# EAGLE board ROHM_102022 (EAGLE 9.6.2), part 1 of 2
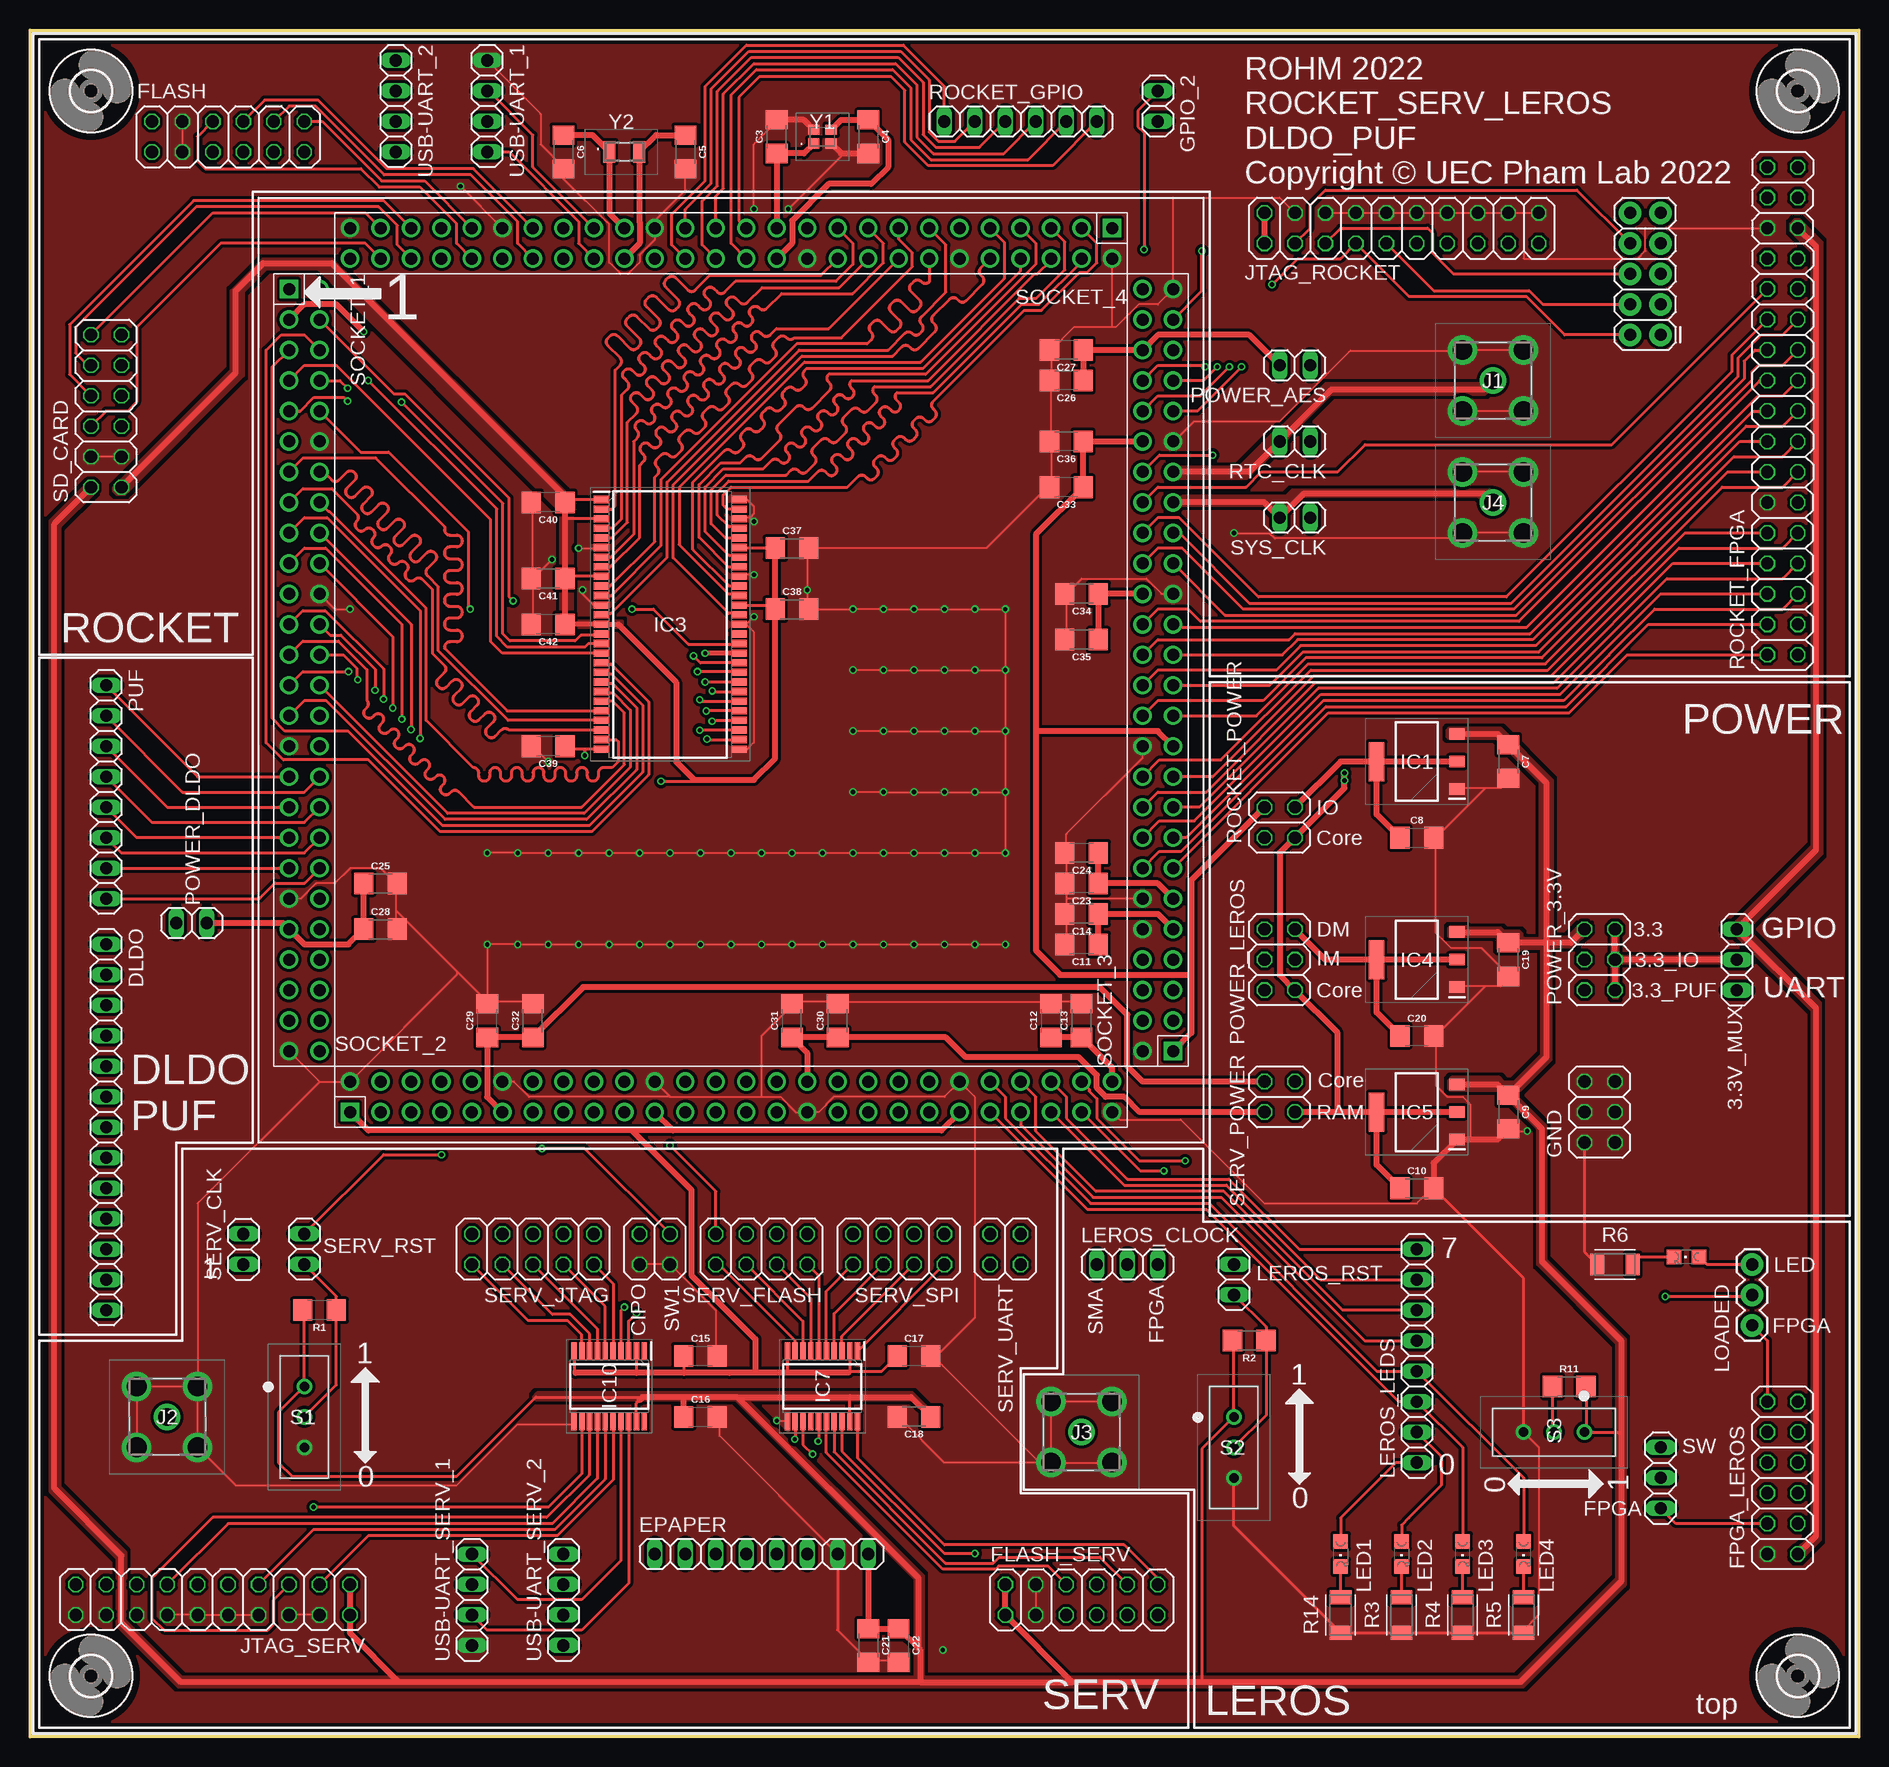
[diagram p5: board, top side]
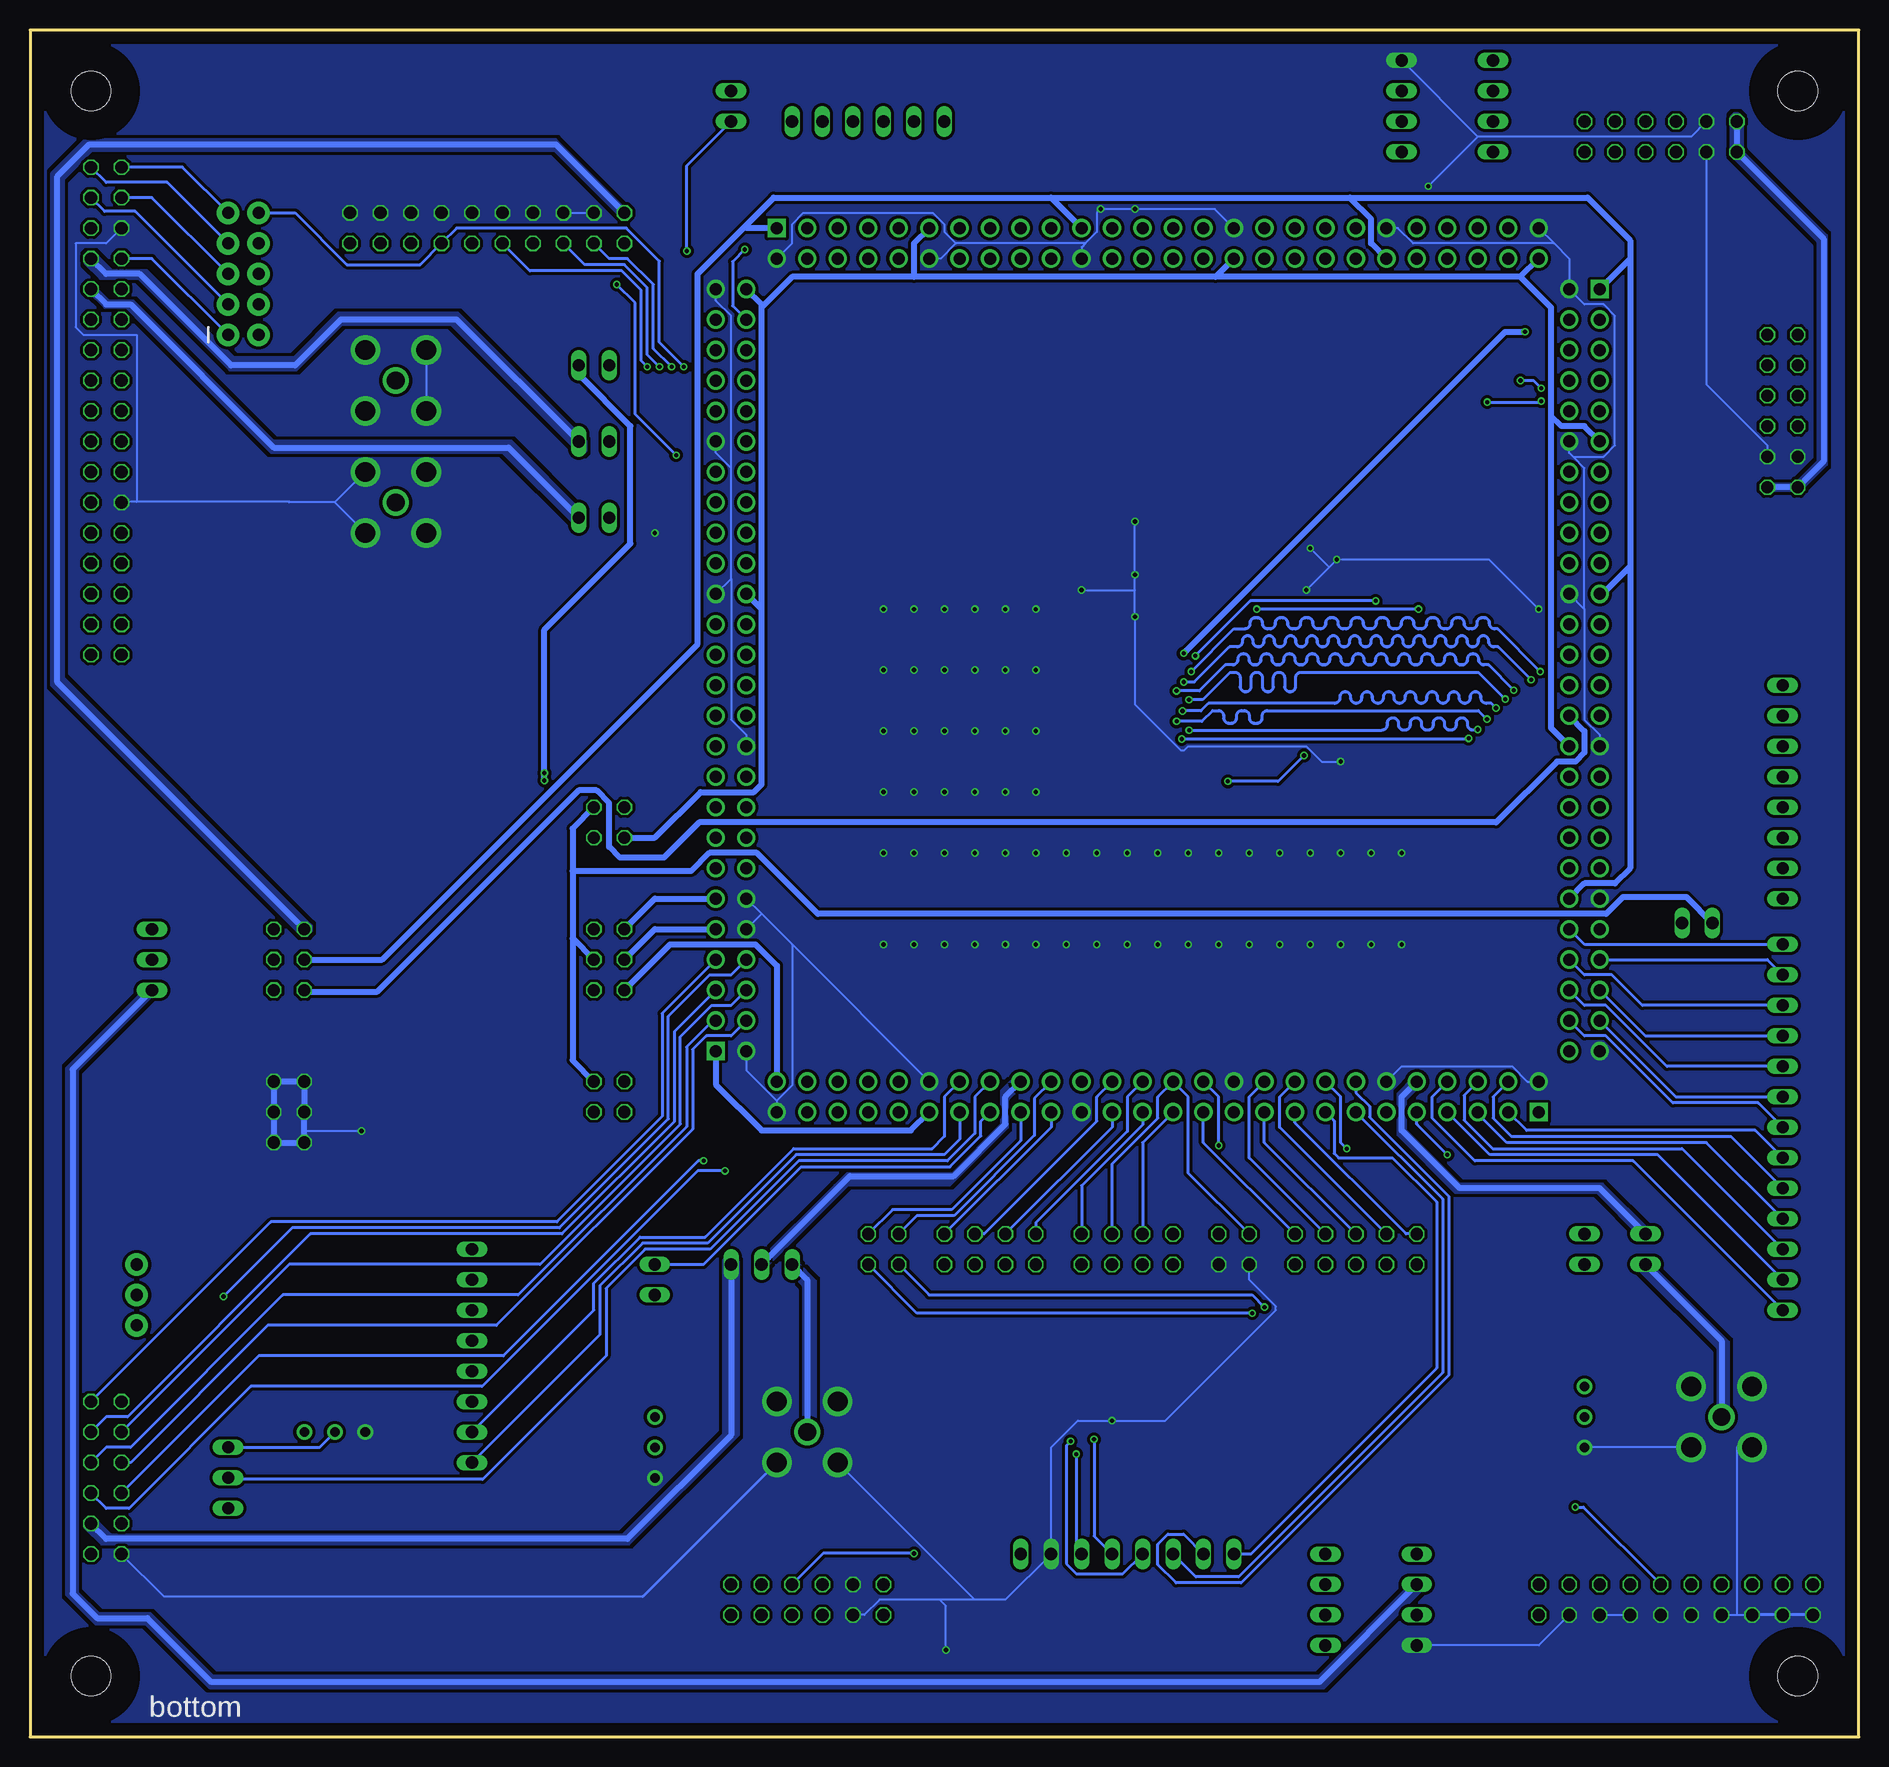
[diagram p6: board, bottom side, seen from below]

Size 152.4 x 142.24 mm. Coordinates in mm from the lower left corner, seen from the top.
Outline: 0,142.24 152.4,142.24 152.4,0 0,0 0,142.24
Copper layers (1*16): Top 0.035mm / dielectric 1.5mm / Bottom 0.035mm
Design rules "default *": minimum track width 6mil, minimum drill 0.35mm, track to track 10mil, track to pad 10mil, pad to pad 6mil, via to via 10mil, smd to smd 10mil, copper to edge 40mil, drill to drill 6mil, minimum pad ring 0.13mm, minimum via ring 0.13mm, stop-mask expansion 4mil, vias tented up to drill 0mil, thermal gap 10mil

## Footprints (pad centres in the part's own frame; a part is rotated, then mirrored left to right if it is on the bottom)
1X03 = drill 1.016 long: 1 -2.54,0; 2 0,0; 3 2.54,0
1206 = smd 1.6 x 1.8: 1 -1.4,0; 2 1.4,0
1X13 = drill 1.016 long: 1 -15.24,0; 2 -12.7,0; 3 -10.16,0; 4 -7.62,0; 5 -5.08,0; 6 -2.54,0; 7 0,0; 8 2.54,0; 9 5.08,0; 10 7.62,0; 11 10.16,0; 12 12.7,0; 13 15.24,0
1X08 = drill 1.016 long: 1 -8.89,0; 2 -6.35,0; 3 -3.81,0; 4 -1.27,0; 5 1.27,0; 6 3.81,0; 7 6.35,0; 8 8.89,0
2X06 = drill 1.016 octagon: 1 -6.35,-1.27; 2 -6.35,1.27; 3 -3.81,-1.27; 4 -3.81,1.27; 5 -1.27,-1.27; 6 -1.27,1.27; 7 1.27,-1.27; 8 1.27,1.27; 9 3.81,-1.27; 10 3.81,1.27; 11 6.35,-1.27; 12 6.35,1.27
2X03 = drill 1.016 octagon: 1 -2.54,-1.27; 2 -2.54,1.27; 3 0,-1.27; 4 0,1.27; 5 2.54,-1.27; 6 2.54,1.27
1X02 = drill 1.016 long: 1 -1.27,0; 2 1.27,0
3,3 = hole 3.3: 0,0
SOT229P700X180-4N = smd 1.3 x 0.95: 1 -3.35,2.29; 2 -3.35,0; 3 -3.35,-2.29 | smd 1.3 x 3.25: 4 3.35,0
SOP80P1176X120-54N = smd 1.295 x 0.6: 1 -5.728,10.4; 2 -5.728,9.6; 3 -5.728,8.8; 4 -5.728,8; 5 -5.728,7.2; 6 -5.728,6.4; 7 -5.728,5.6; 8 -5.728,4.8; 9 -5.728,4; 10 -5.728,3.2; 11 -5.728,2.4; 12 -5.728,1.6; 13 -5.728,0.8; 14 -5.728,0; 15 -5.728,-0.8; 16 -5.728,-1.6; 17 -5.728,-2.4; 18 -5.728,-3.2; 19 -5.728,-4; 20 -5.728,-4.8; 21 -5.728,-5.6; 22 -5.728,-6.4; 23 -5.728,-7.2; 24 -5.728,-8; 25 -5.728,-8.8; 26 -5.728,-9.6; 27 -5.728,-10.4; 28 5.728,-10.4; 29 5.728,-9.6; 30 5.728,-8.8; 31 5.728,-8; 32 5.728,-7.2; 33 5.728,-6.4; 34 5.728,-5.6; 35 5.728,-4.8; 36 5.728,-4; 37 5.728,-3.2; 38 5.728,-2.4; 39 5.728,-1.6; 40 5.728,-0.8; 41 5.728,0; 42 5.728,0.8; 43 5.728,1.6; 44 5.728,2.4; 45 5.728,3.2; 46 5.728,4; 47 5.728,4.8; 48 5.728,5.6; 49 5.728,6.4; 50 5.728,7.2; 51 5.728,8; 52 5.728,8.8; 53 5.728,9.6; 54 5.728,10.4
SOP65P640X120-20N = smd 1.475 x 0.45: 1 -2.938,2.925; 2 -2.938,2.275; 3 -2.938,1.625; 4 -2.938,0.975; 5 -2.938,0.325; 6 -2.938,-0.325; 7 -2.938,-0.975; 8 -2.938,-1.625; 9 -2.938,-2.275; 10 -2.938,-2.925; 11 2.938,-2.925; 12 2.938,-2.275; 13 2.938,-1.625; 14 2.938,-0.975; 15 2.938,-0.325; 16 2.938,0.325; 17 2.938,0.975; 18 2.938,1.625; 19 2.938,2.275; 20 2.938,2.925
29856004 = drill 1.64 pad 2.46: 1 0,0; 2 5.08,0; 3 5.08,5.08; 4 0,5.08 | drill 1.47 pad 2.205: 5 2.54,2.54
1X03' = drill 1.016 pad 1.88: 1 0,0; 2 2.54,0; 3 5.08,0
2X5 = drill 1.016 pad 1.88: 1 0,0; 2 0,2.54; 3 2.54,0; 4 2.54,2.54; 5 5.08,0; 6 5.08,2.54; 7 7.62,0; 8 7.62,2.54; 9 10.16,0; 10 10.16,2.54
2X02 = drill 1.016 octagon: 1 -1.27,-1.27; 2 -1.27,1.27; 3 1.27,-1.27; 4 1.27,1.27
2X10 = drill 1.016 octagon: 1 -11.43,-1.27; 2 -11.43,1.27; 3 -8.89,-1.27; 4 -8.89,1.27; 5 -6.35,-1.27; 6 -6.35,1.27; 7 -3.81,-1.27; 8 -3.81,1.27; 9 -1.27,-1.27; 10 -1.27,1.27; 11 1.27,-1.27; 12 1.27,1.27; 13 3.81,-1.27; 14 3.81,1.27; 15 6.35,-1.27; 16 6.35,1.27; 17 8.89,-1.27; 18 8.89,1.27; 19 11.43,-1.27; 20 11.43,1.27
CHIPLED_0805 = smd 1.2 x 1.2: A 0,-1.05; C 0,1.05
RESC3216X70 = smd 1.165 x 1.815: 1 -1.475,0; 2 1.475,0
2X17 = drill 1.016 octagon: 1 -20.32,-1.27; 2 -20.32,1.27; 3 -17.78,-1.27; 4 -17.78,1.27; 5 -15.24,-1.27; 6 -15.24,1.27; 7 -12.7,-1.27; 8 -12.7,1.27; 9 -10.16,-1.27; 10 -10.16,1.27; 11 -7.62,-1.27; 12 -7.62,1.27; 13 -5.08,-1.27; 14 -5.08,1.27; 15 -2.54,-1.27; 16 -2.54,1.27; 17 0,-1.27; 18 0,1.27; 19 2.54,-1.27; 20 2.54,1.27; 21 5.08,-1.27; 22 5.08,1.27; 23 7.62,-1.27; 24 7.62,1.27; 25 10.16,-1.27; 26 10.16,1.27; 27 12.7,-1.27; 28 12.7,1.27; 29 15.24,-1.27; 30 15.24,1.27; 31 17.78,-1.27; 32 17.78,1.27; 33 20.32,-1.27; 34 20.32,1.27
1X06 = drill 1.016 long: 1 -6.35,0; 2 -3.81,0; 3 -1.27,0; 4 1.27,0; 5 3.81,0; 6 6.35,0
SS12SDP2 = drill 0.8 pad 1.3: 1 0,2.54; 2 0,0; 3 0,-2.54
2X04 = drill 1.016 octagon: 1 -3.81,-1.27; 2 -3.81,1.27; 3 -1.27,-1.27; 4 -1.27,1.27; 5 1.27,-1.27; 6 1.27,1.27; 7 3.81,-1.27; 8 3.81,1.27
2X05 = drill 1.016 octagon: 1 -5.08,-1.27; 2 -5.08,1.27; 3 -2.54,-1.27; 4 -2.54,1.27; 5 0,-1.27; 6 0,1.27; 7 2.54,-1.27; 8 2.54,1.27; 9 5.08,-1.27; 10 5.08,1.27
2X26_HEADER = drill 1 pad 1.524 square: 1 -31.75,-1.27 | drill 1 pad 1.524: 2 -31.75,1.27; 3 -29.21,-1.27; 4 -29.21,1.27; 5 -26.67,-1.27; 6 -26.67,1.27; 7 -24.13,-1.27; 8 -24.13,1.27; 9 -21.59,-1.27; 10 -21.59,1.27; 11 -19.05,-1.27; 12 -19.05,1.27; 13 -16.51,-1.27; 14 -16.51,1.27; 15 -13.97,-1.27; 16 -13.97,1.27; 17 -11.43,-1.27; 18 -11.43,1.27; 19 -8.89,-1.27; 20 -8.89,1.27; 21 -6.35,-1.27; 22 -6.35,1.27; 23 -3.81,-1.27; 24 -3.81,1.27; 25 -1.27,-1.27; 26 -1.27,1.27; 27 1.27,-1.27; 28 1.27,1.27; 29 3.81,-1.27; 30 3.81,1.27; 31 6.35,-1.27; 32 6.35,1.27; 33 8.89,-1.27; 34 8.89,1.27; 35 11.43,-1.27; 36 11.43,1.27; 37 13.97,-1.27; 38 13.97,1.27; 39 16.51,-1.27; 40 16.51,1.27; 41 19.05,-1.27; 42 19.05,1.27; 43 21.59,-1.27; 44 21.59,1.27; 45 24.13,-1.27; 46 24.13,1.27; 47 26.67,-1.27; 48 26.67,1.27; 49 29.21,-1.27; 50 29.21,1.27; 51 31.75,-1.27; 52 31.75,1.27
1X04 = drill 1.016 long: 1 -3.81,0; 2 -1.27,0; 3 1.27,0; 4 3.81,0
Q22FA1280034500 = smd 0.95 x 0.85: 1 -0.725,-0.575; 2 0.725,-0.575; 3 0.725,0.575; 4 -0.725,0.575
Q13FC1350000400 = smd 1 x 1.8: 1 -1.25,0; 2 1.25,0

## Placement (x,y rotation side)
3.3V_MUX  [1X03]  142.24,64.77 90 top
C3  10pF  [1206]  62.23,133.35 90 top
C4  10pF  [1206]  69.85,133.35 270 top
C5  15pF  [1206]  54.61,132.08 270 top
C6  15pF  [1206]  44.45,132.08 270 top
C7  100uF  [1206]  123.19,81.28 270 top
C8  22uF  [1206]  115.57,74.93 0 top
C9  100uF  [1206]  123.19,52.07 270 top
C10  22uF  [1206]  115.57,45.72 0 top
C11  0.1uF  [1206]  87.63,66.04 180 top
C12  0.1uF  [1206]  85.09,59.69 90 top
C13  10uF  [1206]  87.63,59.69 90 top
C14  10uF  [1206]  87.63,68.58 180 top
C15  0.1uF  [1206]  55.88,31.75 0 top
C16  0.1uF  [1206]  55.88,26.67 0 top
C17  0.1uF  [1206]  73.66,31.75 0 top
C18  0.1uF  [1206]  73.66,26.67 180 top
C19  100uF  [1206]  123.19,64.77 270 top
C20  22uF  [1206]  115.57,58.42 0 top
C21  0.1uF  [1206]  69.85,7.62 270 top
C22  10uF  [1206]  72.39,7.62 270 top
C23  0.1uF  [1206]  87.63,71.12 180 top
C24  10uF  [1206]  87.63,73.66 180 top
C25  0.1uF  [1206]  29.21,71.12 0 top
C26  0.1uF  [1206]  86.36,113.03 180 top
C27  10uF  [1206]  86.36,115.57 180 top
C28  10uF  [1206]  29.21,67.31 0 top
C29  0.1uF  [1206]  38.1,59.69 90 top
C30  0.1uF  [1206]  67.31,59.69 90 top
C31  10uF  [1206]  63.5,59.69 90 top
C32  10uF  [1206]  41.91,59.69 90 top
C33  0.1uF  [1206]  86.36,104.14 180 top
C34  0.1uF  [1206]  87.63,95.25 180 top
C35  10uF  [1206]  87.63,91.44 180 top
C36  10uF  [1206]  86.36,107.95 180 top
C37  0.1uF  [1206]  63.5,99.06 0 top
C38  0.1uF  [1206]  63.5,93.98 0 top
C39  0.1uF  [1206]  43.18,82.55 180 top
C40  0.1uF  [1206]  43.18,102.87 180 top
C41  0.1uF  [1206]  43.18,96.52 180 top
C42  0.1uF  [1206]  43.18,92.71 180 top
DLDO  [1X13]  6.35,50.8 270 top
EPAPER  [1X08]  60.96,15.24 0 top
FLASH  PINHD-2X6  [2X06]  16.51,133.35 0 top
FLASH_SERV  PINHD-2X6  [2X06]  87.63,11.43 0 top
FPGA_LEROS  [2X06]  146.05,21.59 90 top
GND  PINHD-2X3  [2X03]  130.81,52.07 90 top
GPIO_2  [1X02]  93.98,135.89 270 top
H1  MOUNT-HOLE3.3  [3,3]  147.32,137.16 0 top
H2  MOUNT-HOLE3.3  [3,3]  147.32,5.08 0 top
H3  MOUNT-HOLE3.3  [3,3]  5.08,5.08 0 top
H4  MOUNT-HOLE3.3  [3,3]  5.08,137.16 0 top
IC1  AMS1117-1.8  [SOT229P700X180-4N]  115.57,81.28 180 top
IC3  W9825G6KH-6I  [SOP80P1176X120-54N]  53.34,92.71 0 top
IC4  AMS1117-1.8  [SOT229P700X180-4N]  115.57,64.77 180 top
IC5  AMS1117-1.8  [SOT229P700X180-4N]  115.57,52.07 180 top
IC7  TXB0108PWR  [SOP65P640X120-20N]  66.04,29.21 270 top
IC10  TXB0108PWR  [SOP65P640X120-20N]  48.26,29.21 270 top
J1  2985-6004  [29856004]  119.38,110.49 0 top
J2  2985-6004  [29856004]  8.89,24.13 0 top
J3  2985-6004  [29856004]  85.09,22.86 0 top
J4  2985-6004  [29856004]  119.38,100.33 0 top
J5  [1X03']  143.51,34.29 90 top
J6  [2X5]  135.89,116.84 90 top
JP1  [1X03]  135.89,21.59 90 top
JP3  PINHD-2X2  [2X02]  52.07,40.64 180 top
JTAG_ROCKET  [2X10]  114.3,125.73 0 top
JTAG_SERV  [2X10]  15.24,11.43 180 top
LED1  [CHIPLED_0805]  109.22,15.24 180 top
LED2  [CHIPLED_0805]  114.3,15.24 180 top
LED3  [CHIPLED_0805]  119.38,15.24 180 top
LED4  [CHIPLED_0805]  124.46,15.24 180 top
LEROS_CLOCK  PINHD-1X3  [1X03]  91.44,39.37 0 top
LEROS_LEDS  [1X08]  115.57,31.75 90 top
LEROS_RST  [1X02]  100.33,38.1 270 top
LOADED  [CHIPLED_0805]  138.05,40.01 90 top
POWER_3.3V  [2X03]  130.81,64.77 90 top
POWER_AES  [1X02]  105.41,114.3 180 top
POWER_DLDO  [1X02]  13.46,67.82 0 top
POWER_LEROS  [2X03]  104.14,64.77 90 top
PUF  [1X08]  6.35,78.74 270 top
R1  10k  [1206]  24.13,35.56 180 top
R2  10k  [1206]  101.6,33.02 180 top
R3  330  [RESC3216X70]  114.3,10.16 90 top
R4  330  [RESC3216X70]  119.38,10.16 90 top
R5  330  [RESC3216X70]  124.46,10.16 90 top
R6  330  [RESC3216X70]  132.08,39.37 0 top
R11  10k  [1206]  128.27,29.21 0 top
R14  330  [RESC3216X70]  109.22,10.16 90 top
ROCKET_FPGA  [2X17]  146.05,110.49 90 top
ROCKET_GPIO  [1X06]  82.55,134.62 0 top
ROCKET_POWER  [2X02]  104.14,76.2 90 top
RTC_CLK  [1X02]  105.41,107.95 180 top
S1  SS12SDP2  [SS12SDP2]  22.86,26.67 0 top
S2  SS12SDP2  [SS12SDP2]  100.33,24.13 0 top
S3  SS12SDP2  [SS12SDP2]  127,25.4 270 top
SD_CARD  PINHD-2X6  [2X06]  6.35,110.49 90 top
SERV_CLK  [1X02]  17.78,40.64 90 top
SERV_FLASH  [2X04]  60.96,40.64 180 top
SERV_JTAG  PINHD-2X5  [2X05]  41.91,40.64 180 top
SERV_POWER  [2X02]  104.14,53.34 90 top
SERV_RST  [1X02]  22.86,40.64 270 top
SERV_SPI  [2X04]  72.39,40.64 180 top
SERV_UART  PINHD-2X2  [2X02]  81.28,40.64 180 top
SOCKET_1  [2X26_HEADER]  22.86,88.9 270 top
SOCKET_2  [2X26_HEADER]  58.42,53.34 0 top
SOCKET_3  [2X26_HEADER]  93.98,88.9 90 top
SOCKET_4  [2X26_HEADER]  58.42,124.46 180 top
SYS_CLK  [1X02]  105.41,101.6 180 top
USB-UART_1  PINHD-1X4  [1X04]  38.1,135.89 270 top
USB-UART_2  PINHD-1X4  [1X04]  30.48,135.89 270 top
USB-UART_SERV_1  PINHD-1X4  [1X04]  36.83,11.43 90 top
USB-UART_SERV_2  PINHD-1X4  [1X04]  44.45,11.43 90 top
Y1  Q22FA1280034500  [Q22FA1280034500]  66.04,133.35 0 top
Y2  Q13FC1350000400  [Q13FC1350000400]  49.53,132.08 0 top

## Tracks (layer width: path | path; a pad name or v marks a point on that pad's centre or on a via)
CLOCK_EXTSERMEM_CLOCK_0
  Top 0.508: SOCKET_3.39 101.6,105.41 RTC_CLK.2 108.46,112.27 121.16,112.27 J1.5
  pour Top (no thermals): 95,105.79 94.87,105.66 94.87,105.03 95,104.9 101.47,104.9 108.46,111.89 121.28,111.89 122.17,112.78 122.17,113.16 121.92,113.41 121.67,113.41 121.03,112.78 107.7,112.78 100.71,105.79
CLOCK_EXTSERMEM_CLOCK_0_GPIO
  Bottom 0.508: RTC_CLK.1 116.84,118.11 126.49,118.11 130.3,114.3 135.64,114.3 143.26,121.92 146.05,121.92 ROCKET_FPGA.27
  pour Bottom (no thermals): 106.05,107.95 116.71,118.62 126.75,118.62 130.43,114.94 135.38,114.94 142.62,122.17 145.54,122.17 147.07,123.7 147.57,123.7 147.83,123.44 147.83,122.81 146.56,121.54 143.38,121.54 135.76,113.92 130.18,113.92 126.36,117.73 117.35,117.73 106.55,106.93 106.3,106.93 106.05,107.19
CLOCK_RTCNODE_RTC_CLOCK_XI
  Top 0.508: SOCKET_4.33 48.28,126.98 Y2.1 46.88,133.48 C6.1
CLOCK_RTCNODE_RTC_CLOCK_XO
  Top 0.508: SOCKET_4.34 50.8,124.46 50.8,126.26 50.78,126.28 Y2.2 52.18,133.48 C5.1
CLOCK_SDRAMCLOCKGROUP_0_XI
  Top 0.508: SOCKET_4.23 C3.1 64.49,131.95 Y1.1
CLOCK_SDRAMCLOCKGROUP_0_XO
  Top 0.508: SOCKET_4.24 63.5,124.46 63.5,126.37 66.55,129.41 70.1,129.41 71.5,130.81 71.5,133.1 C4.1 67.59,134.75 Y1.3
DLDO_PAD_COARSE_0
  Bottom 0.254: SOCKET_2.3 27.69,50.55 8.64,50.55 DLDO.8
DLDO_PAD_COMP1_0
  Bottom 0.254: SOCKET_1.47 17.78,58.42 DLDO.4
DLDO_PAD_FINE_0
  Bottom 0.254: DLDO.9 10.67,50.04 28.96,50.04 30.48,51.56 30.48,53.34 SOCKET_2.4
DLDO_PAD_I_FRZ_0
  Bottom 0.254: DLDO.3 18.03,60.96 20.57,63.5 22.86,63.5 SOCKET_1.46
DLDO_PAD_I_SET_0
  Bottom 0.254: SOCKET_1.45 7.62,64.77 DLDO.2
DLDO_PAD_SIG1_0
  Bottom 0.254: SOCKET_2.5 31.75,51.94 29.34,49.53 12.7,49.53 DLDO.10
DLDO_PAD_SIG2_0
  Bottom 0.254: DLDO.11 14.73,49.02 30.52,49.02 32.89,51.39 32.89,53.47 SOCKET_2.6
DLDO_PAD_SIG3_0
  Bottom 0.254: SOCKET_2.7 30.73,48.51 16.76,48.51 DLDO.12
DLDO_PAD_SIG4_0
  Bottom 0.254: DLDO.13 18.8,48.01 32,48.01 35.56,51.56 35.56,53.34 SOCKET_2.8
DLDO_PAD_VDDP_0
  Top 0.508: POWER_DLDO.2 21.08,67.82 SOCKET_1.43 22.86,66.04 26.54,66.04 C28.1 C25.1
DLDO_PAD_VOUT_0
  Bottom 0.254: DLDO.1 6.38,66.02 22.84,66.02 SOCKET_1.44
DLDO_PAD_VREF1_0
  Bottom 0.254: SOCKET_1.49 15.24,53.34 DLDO.6
DLDO_PAD_VREF2_0
  Bottom 0.254: SOCKET_1.50 22.86,58.42 21.08,58.42 15.49,52.83 8.38,52.83 DLDO.7
DLDO_PAD_VREF_0
  Bottom 0.254: DLDO.5 16,55.88 21.08,60.96 22.86,60.96 SOCKET_1.48
FPGA_CLK_LEROS
  Bottom 0.508: LEROS_CLOCK.3 93.98,25.15 102.62,16.51 146.05,16.51 FPGA_LEROS.3
  pour Bottom (no thermals): 93.34,39.5 93.34,25.15 102.49,16 146.43,16 147.83,17.4 147.83,18.03 147.57,18.29 147.07,18.29 146.3,17.53 145.67,16.89 143.13,16.89 103,16.89 94.62,25.27 94.62,39.75 94.49,39.88 93.73,39.88 93.6,39.88 93.34,39.62
FPGA_GPIO_LEFT_0_0
  Top 0.254: ROCKET_GPIO.1 76.2,137.54 72.77,140.97 59.69,140.97 56.26,137.54 56.26,129.67 53.47,126.87 53.47,124.33 SOCKET_4.30
FPGA_GPIO_LEFT_0_1
  Top 0.254: SOCKET_4.29 54.61,127.3 56.77,129.46 56.77,137.33 59.9,140.46 72.56,140.46 74.93,138.09 74.93,133.73 75.7,132.96 77.08,132.96 ROCKET_GPIO.2
FPGA_GPIO_LEFT_0_2
  Top 0.254: SOCKET_4.28 56.01,124.33 56.01,127.98 57.28,129.25 57.28,137.12 60.11,139.95 72.35,139.95 74.42,137.88 74.42,133.52 75.49,132.46 79.12,132.46 ROCKET_GPIO.3
FPGA_GPIO_LEFT_0_3
  Top 0.254: SOCKET_4.27 57.15,128.4 57.79,129.04 57.79,136.91 60.32,139.45 72.14,139.45 73.91,137.67 73.91,133.31 75.28,131.95 81.15,131.95 ROCKET_GPIO.4
FPGA_GPIO_LEFT_0_4
  Top 0.254: SOCKET_4.26 58.42,124.46 58.42,136.83 60.53,138.94 71.88,138.94 73.41,137.41 73.41,133.1 75.07,131.44 83.18,131.44 ROCKET_GPIO.5
FPGA_GPIO_LEFT_0_5
  Top 0.254: ROCKET_GPIO.6 85.21,130.93 74.86,130.93 72.9,132.89 72.9,137.2 71.78,138.32 60.76,138.32 59.07,136.63 59.07,126.35 SOCKET_4.25
GND  (via drill 0.35)
  Top 0.152: J4.2 J4.1 119.38,100.28 118.97,99.87 103.73,99.87 103.33,100.28 100.48,100.28 v100.33,100.33 | J4.3 J4.4 | 121.28,79.06 122.56,79.06 123.19,79.69 C7.2 | 121.28,79.06 119.06,79.06 IC1.1 | 121.28,79.06 117.16,74.93 | 121.28,62.55 122.56,62.55 123.19,63.18 C19.2 123.19,63.5 120.97,65.72 118.43,65.72 117.16,66.99 117.16,74.93 | 121.28,62.55 119.06,62.55 IC4.1 | 121.28,62.55 117.16,58.42 | 120.02,49.78 120.02,52.71 119.38,53.34 118.11,53.34 117.16,54.29 117.16,58.42 | 117.16,58.42 C20.2 | 117.16,74.93 C8.2 | v124.78,50.48 123.19,50.48 C9.2 | JTAG_SERV.14 JTAG_SERV.12 JTAG_SERV.10 JTAG_SERV.8 | JTAG_SERV.4 JTAG_SERV.6 | J2.1 J2.4 J2.3 | IC10.11 45.4,26.04 40.64,26.04 35.56,20.96 17.15,20.96 J2.2 J2.3 | J3.3 J3.4 J3.1 | 84.14,22.86 76.2,22.86 72.39,26.67 C18.2 | 84.14,22.86 75.25,31.75 C17.2 75.56,31.75 78.74,34.93 78.74,53.34 SOCKET_2.42 76.2,53.34 66.99,53.34 65.72,52.07 SOCKET_2.31 63.82,52.07 62.55,53.34 60.96,53.34 | 84.14,22.86 J3.1 | J3.1 J3.2 | C15.2 57.15,31.75 57.15,35.56 JP3.2 JP3.4 | FLASH_SERV.4 FLASH_SERV.3 | 69.85,6.35 72.39,6.35 C22.2 | v62.23,26.35 63.18,26.35 IC7.11 | EPAPER.7 57.47,25.08 57.47,26.67 C16.2 | 67.31,8.89 69.85,6.35 | 69.85,6.35 C21.2 | v46.04,95.57 46.04,95.25 46.99,94.3 47.31,94.3 IC3.12 | 41.91,96.52 v43.5,98.11 | v45.72,99.06 47.31,99.06 IC3.6 | 41.91,96.52 41.91,92.71 C42.2 | 41.91,96.52 41.91,102.87 C40.2 | 41.91,96.52 C41.2 | v26.67,93.98 25.4,93.98 SOCKET_1.22 | USB-UART_1.1 42.55,135.25 42.55,132.72 44.45,130.81 C6.2 44.45,129.86 48.26,126.05 48.26,122.87 49.21,121.92 49.85,121.92 50.8,122.87 50.8,123.51 52.07,124.78 SOCKET_4.31 52.07,126.37 54.61,128.91 C5.2
  Top 0.152: SD_CARD.3 SD_CARD.4 | FLASH.4 FLASH.3 | v35.88,129.22 SOCKET_4.41 | 24.13,54.61 SOCKET_2.2 35.56,63.5 35.56,63.82 | SOCKET_1.51 24.13,54.61 | 38.1,61.28 41.91,61.28 C32.2 | 30.48,71.12 30.48,68.9 | 30.48,68.9 30.48,67.31 C28.2 | SOCKET_1.41 22.54,69.85 23.81,71.12 25.4,71.12 26.67,72.39 29.21,72.39 30.48,71.12 | 30.48,71.12 C25.2 | 30.48,68.9 35.56,63.82 | 35.56,63.82 38.1,61.28 | 38.1,61.28 C29.2 v38.1,66.04 v40.64,66.04 v43.18,66.04 v45.72,66.04 v48.26,66.04 v50.8,66.04 v53.34,66.04 v55.88,66.04 v58.42,66.04 v60.96,66.04 v63.5,66.04 v66.04,66.04 v68.58,66.04 v71.12,66.04 v73.66,66.04 v76.2,66.04 v78.74,66.04 v81.28,66.04 | 85.09,61.28 87.63,61.28 C13.2 | 67.31,61.28 63.5,61.28 C31.2 63.5,60.96 60.96,58.42 60.96,53.34 | 67.31,61.28 85.09,61.28 | 85.09,61.28 C12.2 | 67.31,61.28 C30.2 | 53.34,53.34 60.96,53.34 | SOCKET_2.22 53.34,53.34 | SOCKET_2.12 40.32,54.61 41.59,53.34 53.34,53.34 | 60.01,101.6 59.37,101.6 IC3.52 | 60.01,101.6 60.33,101.92 60.33,102.55 59.69,103.19 59.37,103.19 IC3.54 | 59.69,92.71 60.33,92.08 60.33,82.87 59.69,82.23 59.37,82.23 IC3.28 | IC3.41 59.69,92.71 | v60.33,96.84 59.37,96.84 IC3.46 | 59.69,92.71 v60.33,93.34 | v43.18,81.28 41.91,82.55 C39.2 | v60.33,101.28 60.01,101.6 | 85.09,115.57 85.09,113.03 | 85.09,107.95 85.09,104.14 C33.2 84.77,104.14 79.69,99.06 C37.2 64.77,99.06 v64.77,95.57 64.77,93.98 C38.2 v68.58,93.98 v71.12,93.98 v73.66,93.98 v76.2,93.98 v78.74,93.98 v81.28,93.98 v81.28,88.9 | 85.09,107.95 85.09,113.03 | 85.09,113.03 C26.2 | 85.09,107.95 C36.2 | J1.2 J1.1 | J1.3 J1.4 119.38,115.52 110.03,115.52 104.14,109.63 97.03,109.63 95.4,108 SOCKET_3.41
  Top 0.152: 86.36,68.58 86.36,66.04 C11.2 | 86.36,73.66 86.36,71.12 | 86.36,71.12 86.36,69.85 | 86.36,69.85 86.36,68.58 | 86.36,68.58 C14.2 | 86.36,71.12 C23.2 | SOCKET_3.22 92.71,81.6 86.36,75.25 86.36,73.66 | 86.36,73.66 C24.2 | SOCKET_3.12 86.36,69.85 | v60.33,127.32 60.33,132.72 62.23,134.62 C3.2 | v63.18,127.32 67.63,131.76 67.63,131.95 | 86.36,95.25 86.36,91.44 C35.2 | SOCKET_3.31 94.3,95.25 93.03,96.52 87.63,96.52 86.36,95.25 | 86.36,95.25 C34.2 | 85.09,115.57 87,117.48 90.17,117.48 | 90.17,117.48 90.49,117.48 92.39,119.38 93.98,119.38 SOCKET_3.51 95.25,128.27 104.14,128.27 JTAG_ROCKET.4 | 85.09,115.57 C27.2 | J2.3 13.97,44.45 24.13,54.61 | SOCKET_2.51 90.81,51.44 95.89,51.44 102.87,44.45 115.57,44.45 116.84,45.72 C10.2 | v38.1,73.66 v40.64,73.66 v43.18,73.66 v45.72,73.66 v48.26,73.66 v50.8,73.66 v53.34,73.66 v55.88,73.66 v58.42,73.66 v60.96,73.66 v63.5,73.66 v66.04,73.66 v68.58,73.66 v71.12,73.66 v73.66,73.66 v76.2,73.66 v78.74,73.66 v81.28,73.66 v81.28,78.74 | v68.58,78.74 v71.12,78.74 v73.66,78.74 v76.2,78.74 v78.74,78.74 v81.28,78.74 | v68.58,83.82 v71.12,83.82 v73.66,83.82 v76.2,83.82 v78.74,83.82 v81.28,83.82 | v81.28,83.82 v81.28,78.74 | v68.58,88.9 v71.12,88.9 v73.66,88.9 v76.2,88.9 v78.74,88.9 v81.28,88.9 | v81.28,88.9 v81.28,83.82 | S3.3 125.73,24.13 125.73,10.16 124.46,8.89 R5.1 | 90.17,117.48 SOCKET_4.2 | JTAG_ROCKET.6 JTAG_ROCKET.8 JTAG_ROCKET.10 JTAG_ROCKET.12 JTAG_ROCKET.14 JTAG_ROCKET.16 JTAG_ROCKET.18 124.46,127 | 124.46,127 JTAG_ROCKET.20 | ROCKET_FPGA.30 134.62,125.73 134.62,123.83 133.99,123.19 124.46,123.19 124.46,127
  Top 0.254: EPAPER.7 67.31,8.89 | R5.1 R4.1 R3.1 R14.1 100.33,17.58 S2.3 | GND.2 129.54,40.44 R6.1 | S3.3 124.46,38.23 C10.2
  Top 0.508: Y1.2 67.59,131.95 67.63,131.95 C4.2 | Y1.4 64.49,134.75 C3.2 | C9.2 122.3,49.78 120.02,49.78 IC5.1 116.97,47.83 C10.2
  Bottom 0.152: 127,102.87 130.81,102.87 130.76,102.92 143.51,102.92 | J4.3 127,102.87 | 127,102.87 J4.2 | v124.78,50.48 129.54,50.48 | JTAG_SERV.14 10.16,10.16 | 10.16,10.16 JTAG_SERV.16 | USB-UART_SERV_1.1 26.67,7.62 JTAG_SERV.4 | JTAG_SERV.6 JTAG_SERV.8 | J2.2 S1.3 | FLASH_SERV.3 82.87,10.16 81.6,11.43 76.58,11.43 | 73.66,11.43 71.12,11.43 EPAPER.7 67.31,24.13 65.09,26.35 v62.23,26.35 57.79,26.35 48.58,35.56 48.58,35.88 50.8,38.1 JP3.4 | 73.66,11.43 76.58,11.43 | 73.66,11.43 J3.1 | SOCKET_4.51 25.4,124.46 | 25.4,124.46 24.13,123.19 SOCKET_1.2 22.86,119.38 21.27,119.38 20.32,118.43 20.32,107.63 21.27,106.68 23.81,106.68 | SOCKET_4.41 38.42,125.73 37.15,124.46 25.4,124.46 | 44.13,97.47 v43.5,98.11 30.8,98.11 v26.67,93.98 | 44.13,97.47 v46.04,95.57 | 44.13,97.47 v45.72,99.06 | SOCKET_1.31 21.59,83.5 22.86,84.77 22.86,93.98 | SOCKET_1.22 22.86,93.98 | SOCKET_1.12 24.13,107 23.81,106.68 | 23.81,106.68 22.86,105.73 22.86,93.98 | SD_CARD.3 7.62,107.63 12.7,112.71 FLASH.3 | 31.75,133.35 USB-UART_1.1 | 31.75,133.35 13.97,133.35 FLASH.4 | 31.75,133.35 v35.88,129.22 | SOCKET_2.2 27.62,54.61 28.89,55.88 38.1,55.88 SOCKET_2.12 | 60.33,95.57 v60.33,93.34 60.33,86.04 56.52,82.23 56.2,82.23 55.88,82.55 46.04,82.55 44.77,81.28 v43.18,81.28 | 60.33,95.57 v60.33,96.84 v60.33,101.28 | v64.77,95.57 60.33,95.57 | J1.4 J1.1 | 90.17,53.02 SOCKET_2.51 | 90.17,53.02 92.71,55.56 SOCKET_3.2 | SOCKET_3.12 91.44,68.58 | 91.44,68.58 88.9,66.04 | 88.9,66.04 SOCKET_2.42 | 91.44,68.58 SOCKET_3.10 | 90.17,53.02 88.9,54.29 88.9,66.04 | SOCKET_4.31 53.66,127.32 v60.33,127.32 v63.18,127.32 63.5,127 63.5,125.41 64.45,124.46 | SOCKET_4.22 64.77,124.14 64.45,124.46
  Bottom 0.152: SOCKET_4.12 76.52,123.19 75.25,124.46 | 64.45,124.46 75.25,124.46 | SOCKET_3.41 95.25,107 93.98,105.73 | 93.98,96.52 93.98,105.73 | SOCKET_3.31 93.98,96.52 | SOCKET_3.51 95.25,119.7 93.98,118.43 93.98,105.73 | 75.25,124.46 76.2,125.41 76.2,126.05 77.15,127 87.95,127 88.9,126.05 88.9,124.46 SOCKET_4.2 | SOCKET_3.22 92.71,83.5 93.98,84.77 93.98,96.52 | 101.35,11.68 141.22,11.68 FPGA_LEROS.2 | v76.07,7.24 76.07,10.92 76.58,11.43 | 143.51,102.92 144.78,102.92 ROCKET_FPGA.12 | 10.16,10.16 10.16,24.13 J2.1 | JTAG_ROCKET.6 JTAG_ROCKET.4 | 143.51,102.92 143.51,116.84 147.95,116.84 148.59,117.48 148.59,124.46 146.05,124.46 ROCKET_FPGA.30
  Bottom 0.254: JTAG_SERV.20 JTAG_SERV.18 JTAG_SERV.16 | J3.2 101.35,11.68
  Bottom 0.508: GND.6 GND.4 129.54,50.48 GND.2 GND.1 GND.3 GND.5 GND.6
  pour Bottom (rank 2, no thermals): -7.62,151.13 162.56,151.13 162.56,123.19 162.56,-11.43 -3.81,-11.43 -7.62,-11.43
  pour Top (rank 2, no thermals): -7.62,151.13 162.56,151.13 162.56,125.73 162.56,-11.43 -7.62,-11.43
GPIO_GPIO_0  (via drill 0.35)
  Top 0.254: v92.83,123.96 92.83,133.69 92.32,134.2 92.32,135.5 GPIO_2.1
  Bottom 0.254: v92.83,123.96 93.85,122.94 93.85,119.25 SOCKET_3.50
GPIO_GPIO_1  (via drill 0.35)
  Top 0.254: SOCKET_3.49 97.66,120.52 v97.66,123.83
  Bottom 0.254: v97.66,123.83 97.66,130.94 GPIO_2.2
JTAG_TCK  (via drill 0.35)
  Top 0.254: v100.97,114.17 97.28,110.49 SOCKET_3.43 | JTAG_ROCKET.9 116.97,120.52 124.92,120.52 126.07,119.38 J6.4
  Bottom 0.254: v100.97,114.17 101.47,114.68 101.47,120.57 103.08,122.17 110.74,122.17 JTAG_ROCKET.9
JTAG_TCK_FPGA
  Bottom 0.254: J6.3 143.64,127.13 146.18,127.13 ROCKET_FPGA.31
JTAG_TDI  (via drill 0.35)
  Top 0.254: SOCKET_3.44 93.98,111.76 97.54,111.76 v99.95,114.17 | JTAG_ROCKET.5 109.22,125.73 116.46,125.73 116.84,125.35 116.84,123.7 118.62,121.92 J6.6
  Bottom 0.254: v99.95,114.17 100.97,115.19 100.97,120.78 102.87,122.68 106.17,122.68 JTAG_ROCKET.5
JTAG_TDI_FPGA
  Bottom 0.254: J6.5 142.24,128.27 ROCKET_FPGA.32
JTAG_TDO  (via drill 0.35)
  Top 0.254: SOCKET_3.46 93.98,114.3 97.79,114.3 v97.92,114.17
  Bottom 0.254: v97.92,114.17 99.95,116.21 99.95,122.98 102.7,125.73 116.84,125.73 JTAG_ROCKET.13 119.89,122.68 125.98,122.68 130.3,127 J6.10
JTAG_TDO_FPGA
  Bottom 0.254: J6.9 139.7,130.81 ROCKET_FPGA.34
JTAG_TMS  (via drill 0.35)
  Top 0.254: v98.55,106.81 94.11,106.81 SOCKET_3.40 | v103.5,121.03 105.66,123.19 109.22,123.19 JTAG_ROCKET.7 114.94,120.02 124.71,120.02 127.89,116.84 J6.2
  Bottom 0.254: v98.55,106.81 101.98,110.24 101.98,119.51 v103.5,121.03
JTAG_TMS_FPGA
  Bottom 0.254: J6.1 142.24,123.19 ROCKET_FPGA.28
JTAG_TRSTN  (via drill 0.35)
  Top 0.254: v98.93,114.17 97.79,113.03 SOCKET_3.45 | JTAG_ROCKET.3 106.68,125.73 106.68,127.64 107.95,128.91 128.91,128.91 J6.8
  Bottom 0.254: v98.93,114.17 100.46,115.7 100.46,121.03 102.61,123.19 104.14,123.19 JTAG_ROCKET.3
JTAG_TRSTN_FPGA
  Bottom 0.254: J6.7 140.97,129.54 146.05,129.54 ROCKET_FPGA.33
LEROS_PAD_CPU_RST_N_0
  Bottom 0.254: LEROS_RST.1 96.27,39.37 88.14,47.5 75.74,47.5 73.15,50.08 73.15,51.31 SOCKET_2.37
LEROS_PAD_I_CLK_0
  Bottom 0.508: LEROS_CLOCK.2 84.07,46.74 75.44,46.74 71.12,51.05 71.12,53.34 SOCKET_2.36
  pour Bottom: 91.06,39.12 84.2,45.97 77.09,45.97 75.69,45.97 70.87,50.8 70.87,53.09 69.98,53.98 69.47,54.48 69.47,54.99 69.6,55.12 70.23,55.12 71.5,53.85 71.5,51.82 71.5,51.05 75.56,46.99 84.33,46.99 85.34,45.97 91.82,39.5 91.82,39.24 91.82,39.12 91.44,38.74
LEROS_PAD_I_SPI_LOADER_CLK_0  (via drill 0.35)
  Top 0.254: v94.49,47.17 92.53,47.17 SOCKET_2.49
  Bottom 0.254: v94.49,47.17 96.77,47.17 114.73,29.21 133.99,29.21 144.14,19.05 146.05,19.05 FPGA_LEROS.5
LEROS_PAD_I_SPI_LOADER_CS_0  (via drill 0.35)
  Top 0.254: v96.27,48.01 92.46,48.01 88.9,51.56 88.9,53.19 88.27,53.82 88.27,53.98 SOCKET_2.50
  Bottom 0.254: v96.27,48.01 96.7,48.01 112.95,31.75 133.35,31.75 FPGA_LEROS.6
LEROS_PAD_I_SPI_LOADER_MOSI_0
  Bottom 0.254: SOCKET_3.3 95.49,59.69 97.69,57.49 97.69,50.86 111.72,36.83 131.32,36.83 144.02,24.13 146.05,24.13 FPGA_LEROS.7
LEROS_PAD_I_SPI_MISO_0
  Bottom 0.254: SOCKET_3.7 99.72,60.3 99.72,51.7 108.5,42.93 132.33,42.93 FPGA_LEROS.11
LEROS_PAD_LOADER_RST_N_0
  Bottom 0.254: SOCKET_2.38 73.66,53.34 73.66,50.29 75.95,48.01 88.35,48.01 95.71,40.64 101.14,40.64 104.39,37.39 104.39,31.75 113.16,22.99 114.68,21.46 135.76,21.46 JP1.2
LEROS_PAD_LOADER_RST_N_0_FPGA
  Top 0.254: FPGA_LEROS.4 137.16,17.78 JP1.1
LEROS_PAD_O_SPI_CLK_0
  Bottom 0.254: SOCKET_3.4 93.98,58.42 96.04,58.42 97.18,57.28 97.18,50.65 113.54,34.29 132.59,34.29 144.02,22.86 FPGA_LEROS.8
LEROS_PAD_O_SPI_CS_0
  Bottom 0.254: SOCKET_3.5 98.7,58.78 98.7,51.28 108.07,41.91 129.03,41.91 144.27,26.67 146.05,26.67 FPGA_LEROS.9
LEROS_PAD_O_SPI_MOSI_0
  Bottom 0.254: SOCKET_3.6 93.98,60.96 95.6,60.96 98.2,58.36 98.2,51.07 109.9,39.37 130.81,39.37 FPGA_LEROS.10
LEROS_PAD_OLEDG_0_0
  Top 0.254: LEROS_LEDS.1 113.82,22.86 109.22,18.26 LED1.A
  Bottom 0.254: SOCKET_2.39 74.93,49.78 76.2,48.51 88.56,48.51 95.93,41.15 101.35,41.15 104.9,37.6 104.9,33.53 LEROS_LEDS.1
LEROS_PAD_OLEDG_0_1
  Top 0.254: LEROS_LEDS.2 117.6,23.37 117.6,20.96 115,18.35 114.91,18.26 114.3,17.65 LED2.A
  Bottom 0.254: SOCKET_2.40 76.2,53.34 76.2,50.04 77.22,49.02 88.77,49.02 96.14,41.66 101.56,41.66 105.41,37.81 105.41,35.56 LEROS_LEDS.2
LEROS_PAD_OLEDG_0_2
  Top 0.254: SOCKET_2.43 88.14,43.94 98.04,43.94 114.05,27.94 LEROS_LEDS.3 119.38,24.13 LED3.A
LEROS_PAD_OLEDG_0_3
  Top 0.254: SOCKET_2.44 81.28,53.34 81.28,51.56 88.39,44.45 98.25,44.45 112.22,30.48 LEROS_LEDS.4 124.46,21.59 LED4.A
LEROS_PAD_OLEDG_0_4
  Top 0.254: LEROS_LEDS.5 111.22,33.02 99.28,44.96 88.6,44.96 82.55,51.01 SOCKET_2.45
LEROS_PAD_OLEDG_0_5
  Top 0.254: SOCKET_2.46 83.82,53.34 83.82,50.46 88.81,45.47 99.49,45.47 109.4,35.56 LEROS_LEDS.6
LEROS_PAD_OLEDG_0_6
  Top 0.254: SOCKET_2.47 91.19,45.97 99.7,45.97 107.57,38.1 LEROS_LEDS.7
LEROS_PAD_OLEDG_0_7
  Top 0.254: SOCKET_2.48 86.36,53.34 86.36,51.56 91.44,46.48 99.91,46.48 105.75,40.64 LEROS_LEDS.8
LEROS_PAD_SRAM_LOADED_0  (via drill 0.35)
  Top 0.254: v136.27,36.7 143.38,36.7 J5.2
  Bottom 0.254: SOCKET_3.8 93.98,63.5 95.76,63.5 99.21,60.05 99.21,51.49 108.29,42.42 130.56,42.42 v136.27,36.7
LEROS_PAD_SRAM_LOADED_0_FPGA
  Top 0.254: J5.1 144.78,33.02 FPGA_LEROS.12
LEROS_PAD_VDD_0
  Top 0.508: SOCKET_2.52 90.17,55.75 C13.1 C12.1
  Bottom 0.508: POWER_LEROS.2 99.06,66.04 91.95,66.04 90.17,64.26 SOCKET_2.52
LEROS_PAD_VDD_DM_RAM_0
  Top 0.508: SOCKET_3.11 93.98,71.12 C23.1 C24.1
  Bottom 0.508: POWER_LEROS.6 100.33,69.85 SOCKET_3.11
LEROS_PAD_VDD_IM_RAM_0
  Top 0.508: C11.1 C14.1 93.98,68.58 SOCKET_3.9
  Bottom 0.508: SOCKET_3.9 100.33,67.31 POWER_LEROS.4
MEMSER_PAD_IN_READY
  Top 0.254: SOCKET_3.36 93.98,101.6 95.76,101.6 102.36,95 123.04,95 141.83,113.79 141.83,115.16 ROCKET_FPGA.24
MEMSER_PAD_IN_VALID
  Top 0.254: SOCKET_3.34 93.98,99.06 96.01,99.06 101.09,93.98 123.66,93.98 142.85,113.17 142.85,114.66 143.76,115.57 ROCKET_FPGA.22
MEMSER_PAD_OUT_BITS_0
  Top 0.254: SOCKET_3.13 108.2,85.34 128.27,85.34 133.1,90.17 ROCKET_FPGA.2
MEMSER_PAD_OUT_BITS_1
  Top 0.254: SOCKET_3.14 94.11,73.79 95.93,73.79 107.99,85.85 128.02,85.85 134.87,92.71 ROCKET_FPGA.4
MEMSER_PAD_OUT_BITS_2
  Top 0.254: SOCKET_3.15 96.35,74.93 107.78,86.36 127.81,86.36 131.57,90.13 131.57,90.17 135.38,93.98 146.05,93.98 ROCKET_FPGA.5
MEMSER_PAD_OUT_BITS_3
  Top 0.254: SOCKET_3.16 94.11,76.33 97.03,76.33 107.57,86.87 127.51,86.87 135.89,95.25 ROCKET_FPGA.6
MEMSER_PAD_OUT_BITS_4
  Top 0.254: SOCKET_3.17 97.46,77.47 107.36,87.38 127.25,87.38 136.4,96.52 146.05,96.52 ROCKET_FPGA.7
MEMSER_PAD_OUT_BITS_5
  Top 0.254: SOCKET_3.18 93.98,78.74 98.01,78.74 107.15,87.88 127,87.88 136.91,97.79 ROCKET_FPGA.8
MEMSER_PAD_OUT_BITS_6
  Top 0.254: SOCKET_3.19 98.56,80.01 106.94,88.39 126.75,88.39 137.41,99.06 146.05,99.06 ROCKET_FPGA.9
MEMSER_PAD_OUT_BITS_7
  Top 0.254: SOCKET_3.20 94.11,81.41 99.24,81.41 106.73,88.9 126.49,88.9 137.92,100.33 ROCKET_FPGA.10
MEMSER_PAD_OUT_READY
  Top 0.254: SOCKET_3.33 99.57,93.47 123.87,93.47 143.51,113.11 143.51,113.79 144.02,114.3 146.05,114.3 ROCKET_FPGA.21
MEMSER_PAD_OUT_VALID
  Top 0.254: SOCKET_3.35 95.76,100.33 101.6,94.49 123.45,94.49 142.34,113.38 142.34,114.91 144.27,116.84 146.05,116.84 ROCKET_FPGA.23
MEMSER_SYSTEM_MEMSER_OUTER_IO_IN_BITS_PAD_IN_BITS_0
  Top 0.254: SOCKET_3.23 102.2,85.09 106.52,89.41 126.28,89.41 141.01,104.14 146.05,104.14 ROCKET_FPGA.13
MEMSER_SYSTEM_MEMSER_OUTER_IO_IN_BITS_PAD_IN_BITS_1
  Top 0.254: SOCKET_3.24 93.98,86.36 102.75,86.36 106.31,89.92 125.98,89.92 141.48,105.41 ROCKET_FPGA.14
MEMSER_SYSTEM_MEMSER_OUTER_IO_IN_BITS_PAD_IN_BITS_2
  Top 0.254: SOCKET_3.25 103.31,87.63 106.1,90.42 125.73,90.42 141.99,106.68 146.05,106.68 ROCKET_FPGA.15
MEMSER_SYSTEM_MEMSER_OUTER_IO_IN_BITS_PAD_IN_BITS_3
  Top 0.254: SOCKET_3.26 93.98,88.9 103.86,88.9 105.89,90.93 125.48,90.93 142.49,107.95 ROCKET_FPGA.16
MEMSER_SYSTEM_MEMSER_OUTER_IO_IN_BITS_PAD_IN_BITS_4
  Top 0.254: SOCKET_3.27 104.38,90.17 105.65,91.44 125.22,91.44 143,109.22 146.05,109.22 ROCKET_FPGA.17
MEMSER_SYSTEM_MEMSER_OUTER_IO_IN_BITS_PAD_IN_BITS_5
  Top 0.254: SOCKET_3.28 93.98,91.44 104.93,91.44 105.43,91.95 125.01,91.95 143.55,110.49 ROCKET_FPGA.18
MEMSER_SYSTEM_MEMSER_OUTER_IO_IN_BITS_PAD_IN_BITS_6
  Top 0.254: SOCKET_3.29 95.5,92.46 124.71,92.46 144.02,111.76 146.05,111.76 ROCKET_FPGA.19
MEMSER_SYSTEM_MEMSER_OUTER_IO_IN_BITS_PAD_IN_BITS_7
  Top 0.254: SOCKET_3.30 93.98,93.98 96.52,93.98 97.54,92.96 124.08,92.96 144.14,113.03 ROCKET_FPGA.20
N$1
  Top 0.254: IC7.1 76.19,39.37 SERV_SPI.2
N$2
  Top 0.254: R14.2 LED1.C
N$3
  Top 0.254: IC7.3 67.67,33.38 SERV_SPI.4
N$4
  Top 0.254: IC7.4 67.02,35.27 SERV_SPI.6
N$5
  Top 0.254: IC7.5 66.37,37.16 SERV_SPI.8
N$6
  Top 0.254: R11.1 126.87,25.53 S3.2
  Bottom 0.254: JP1.3 128.27,24.13 S3.2
N$7
  Top 0.254: R3.2 LED2.C
N$8
  Top 0.254: R4.2 LED3.C
N$9
  Top 0.254: R5.2 LED4.C
N$10
  Top 0.254: SERV_FLASH.2 65.72,38.43 IC7.6
N$11
  Top 0.254: SERV_FLASH.4 65.06,36.54 IC7.7
N$12
  Top 0.254: SERV_FLASH.6 64.42,34.65 IC7.8
N$13
  Top 0.254: IC7.9 63.77,33.01 57.4,39.37 SERV_FLASH.8
N$14
  Top 0.254: R6.2 134.19,40.01 LOADED.C
N$15
  Top 0.254: LOADED.A 139.73,39.37 J5.3
N$23
  Top 0.254: IC10.9 45.97,33.53 44.81,34.7 41.5,34.7 SERV_JTAG.10
N$24
  Top 0.254: SERV_JTAG.8 43.54,35.2 45.02,35.2 46.64,33.59 IC10.8
N$25
  Top 0.254: SERV_JTAG.6 47.29,34 IC10.7
N$26
  Top 0.254: IC10.6 47.94,35.89 SERV_JTAG.4
N$27
  Top 0.254: SERV_JTAG.2 48.59,37.78 IC10.5
N$28  (via drill 0.35)
  Top 0.254: v49.53,35.81 49.23,35.52 IC10.4
  Bottom 0.254: SERV_UART.4 77.47,36.83 50.55,36.83 v49.53,35.81
N$29  (via drill 0.35)
  Top 0.254: IC10.3 49.89,34.65 v50.55,35.31
  Bottom 0.254: v50.55,35.31 78.49,35.31 SERV_UART.2
PUF_PUF_TG_0_0
  Top 0.254: PUF.1 13.97,80.01 SOCKET_1.33
PUF_PUF_TG_0_1
  Top 0.254: PUF.2 12.7,78.74 22.86,78.74 SOCKET_1.34
PUF_PUF_TG_0_2
  Top 0.254: PUF.3 11.43,77.47 SOCKET_1.35
PUF_PUF_TG_0_3
  Top 0.254: PUF.4 10.16,76.2 22.86,76.2 SOCKET_1.36
PUF_PUF_TG_0_4
  Top 0.254: SOCKET_1.37 8.89,74.93 PUF.5
PUF_PUF_TG_0_5
  Top 0.254: PUF.6 7.62,73.66 22.86,73.66 SOCKET_1.38
PUF_PUF_TG_0_6
  Top 0.254: PUF.7 SOCKET_1.39
PUF_PUF_TG_0_7
  Top 0.254: PUF.8 19.1,69.85 20.4,71.15 22.89,71.15 SOCKET_1.40
PUF_PUF_VDDH_0
  Bottom 0.508: SOCKET_1.30 22.86,83.82 22.86,82.02 23.6,81.28 25.15,81.28 30.23,76.2 96.65,76.2 99.57,73.28 103.25,73.28 104.14,74.17 104.14,77.82 105.19,78.87 106.68,78.87 123.44,62.1 129.41,62.1 POWER_3.3V.2
RST_SW
  Top 0.254: SERV_RST.2 25.53,36.7 R1.1 25.53,29.34 S1.2
RST_SW1
  Top 0.254: LEROS_RST.2 103,34.16 R2.1 103,26.8 S2.2
SDRAMIO_SDRAM_ADDR_O_0
  Top 0.254: SOCKET_1.13 22.73,106.55 28.83,106.55 34.54,100.84 34.54,100.59 arc90 34.99,100.15 35.56,100.15 arc-90 36,99.71 36,99.61 arc-90 35.56,99.16 34.99,99.16 arc90 34.54,98.72 34.54,98.62 arc90 34.99,98.17 35.56,98.17 arc-90 36,97.73 36,97.63 arc-90 35.56,97.18 34.99,97.18 arc90 34.54,96.74 34.54,96.64 arc90 34.99,96.2 35.56,96.2 arc-90 36,95.75 36,95.65 arc-90 35.56,95.21 34.99,95.21 arc90 34.54,94.76 34.54,94.66 arc90 34.99,94.22 35.56,94.22 arc-90 36,93.77 36,93.67 arc-90 35.56,93.23 34.99,93.23 arc90 34.54,92.78 34.54,92.68 arc90 34.99,92.24 35.56,92.24 arc-90 36,91.79 36,91.69 arc-90 35.56,91.25 34.99,91.25 arc90 34.54,90.81 34.54,90.72 39.75,85.51 IC3.23
SDRAMIO_SDRAM_ADDR_O_1
  Top 0.254: SOCKET_1.14 24.47,105.41 25.13,104.75 arc90 25.76,104.75 26.38,105.38 arc-90 27.01,105.38 27.05,105.34 arc-90 27.05,104.71 26.43,104.08 arc90 26.43,103.45 26.47,103.41 arc90 27.1,103.41 27.72,104.04 arc-90 28.35,104.04 28.39,104 arc-90 28.39,103.37 27.77,102.74 arc90 27.77,102.11 27.81,102.07 arc90 28.44,102.07 29.06,102.7 arc-90 29.69,102.7 29.73,102.66 arc-90 29.73,102.03 29.11,101.4 arc90 29.11,100.77 29.15,100.73 arc90 29.78,100.73 30.4,101.36 arc-90 31.03,101.36 31.07,101.31 arc-90 31.07,100.69 30.45,100.06 arc90 30.45,99.43 30.49,99.39 arc90 31.12,99.39 31.74,100.02 arc-90 32.37,100.02 32.41,99.98 arc-90 32.41,99.35 31.79,98.72 arc90 31.79,98.09 31.83,98.05 arc90 32.45,98.05 33.08,98.68 arc-90 33.71,98.68 33.75,98.64 arc-90 33.75,98.01 33.12,97.38 arc90 33.12,96.75 34.04,95.84 34.04,90.51 39.83,84.71 IC3.24
SDRAMIO_SDRAM_ADDR_O_2
  Top 0.254: SOCKET_1.15 22.73,104.01 25.15,104.01 27.22,101.94 arc-90 27.22,101.31 arc90 27.22,100.68 27.29,100.62 arc90 27.92,100.62 arc-90 28.54,100.62 28.61,100.55 arc-90 28.61,99.92 arc90 28.61,99.29 28.67,99.23 arc90 29.3,99.23 arc-90 29.93,99.23 29.99,99.17 arc-90 29.99,98.54 arc90 29.99,97.91 30.06,97.84 arc90 30.69,97.84 arc-90 31.32,97.84 31.38,97.78 arc-90 31.38,97.15 arc90 31.38,96.52 31.45,96.46 arc90 32.07,96.46 arc-90 32.7,96.46 33.53,95.63 33.53,90.3 34.52,89.31 arc-90 34.52,88.68 34,88.16 arc90 34,87.53 34.06,87.48 arc90 34.68,87.48 35.2,88 arc-90 35.83,88 35.88,87.95 arc-90 35.88,87.32 35.37,86.8 arc90 35.37,86.17 35.42,86.12 arc90 36.05,86.12 36.56,86.64 arc-90 37.19,86.64 37.24,86.58 arc-90 37.24,85.95 36.73,85.44 arc90 36.73,84.81 36.78,84.76 arc90 37.41,84.76 37.92,85.27 arc-90 38.55,85.27 38.61,85.22 arc-90 38.61,84.59 38.09,84.08 arc90 38.09,83.45 38.14,83.39 arc90 38.77,83.39 39.29,83.91 arc-90 39.92,83.91 IC3.25
SDRAMIO_SDRAM_ADDR_O_3
  Top 0.254: SOCKET_1.16 24.89,102.11 24.98,102.11 33.02,94.06 33.02,84.71 36.96,80.77 arc-90 37.4,80.33 37.4,80.08 arc90 37.85,79.64 37.86,79.64 arc90 38.31,80.08 38.31,80.33 arc-90 38.75,80.77 38.77,80.77 arc-90 39.21,80.33 39.21,80.08 arc90 39.66,79.64 39.67,79.64 arc90 40.12,80.08 40.12,80.33 arc-90 40.56,80.77 40.58,80.77 arc-90 41.02,80.33 41.02,80.08 arc90 41.47,79.64 41.48,79.64 arc90 41.93,80.08 41.93,80.33 arc-90 42.37,80.77 42.39,80.77 arc-90 42.83,80.33 42.83,80.08 arc90 43.28,79.64 43.29,79.64 arc90 43.74,80.08 43.74,80.33 arc-90 44.18,80.77 44.2,80.77 arc-90 44.64,80.33 44.64,80.08 arc90 45.09,79.64 45.1,79.64 arc90 45.55,80.08 45.55,80.33 arc-90 45.99,80.77 46.01,80.77 arc-90 46.45,80.33 46.45,80.08 arc90 46.9,79.64 46.91,79.64 arc90 47.36,80.08 47.36,80.33 arc-90 47.8,80.77 48.51,80.77 49.02,81.28 49.02,82.93 48.84,83.11 IC3.26
SDRAMIO_SDRAM_ADDR_O_4  (via drill 0.35)
  Top 0.254: SOCKET_1.17 22.86,101.6 24.77,101.6 32.51,93.85 v32.51,83.21 | v56.42,83.15 56.46,83.11 IC3.29
  Bottom 0.254: v32.51,83.21 32.56,83.15 v56.42,83.15
SDRAMIO_SDRAM_ADDR_O_5  (via drill 0.35)
  Top 0.254: v55.81,83.89 55.82,83.91 IC3.30 | v31.75,83.95 31.75,92.71 SOCKET_1.18
  Bottom 0.254: v31.75,83.95 31.8,83.89 32.15,83.89 arc90 32.6,84.34 32.6,84.46 arc-90 33.04,84.9 33.11,84.9 arc-90 33.56,84.46 33.56,84.34 arc90 34,83.89 34.07,83.89 arc90 34.51,84.34 34.51,84.46 arc-90 34.96,84.9 35.03,84.9 arc-90 35.47,84.46 35.47,84.34 arc90 35.92,83.89 35.99,83.89 arc90 36.43,84.34 36.43,84.46 arc-90 36.88,84.9 36.95,84.9 arc-90 37.39,84.46 37.39,84.34 arc90 37.83,83.89 37.9,83.89 arc90 38.35,84.34 38.35,84.46 arc-90 38.79,84.9 38.86,84.9 arc-90 39.31,84.46 39.31,84.34 arc90 39.75,83.89 v55.81,83.89
SDRAMIO_SDRAM_ADDR_O_6  (via drill 0.35)
  Top 0.254: SOCKET_1.19 22.86,99.06 24.64,99.06 30.99,92.71 v30.99,84.81 | v56.85,84.63 56.92,84.71 IC3.31
  Bottom 0.254: v56.85,84.63 54.74,84.63 53.85,85.52 53.37,85.52 arc90 52.92,85.08 52.92,84.92 arc-90 52.48,84.47 52.3,84.47 arc-90 51.86,84.92 51.86,85.08 arc90 51.41,85.52 51.23,85.52 arc90 50.79,85.08 50.79,84.92 arc-90 50.34,84.47 50.16,84.47 arc-90 49.72,84.92 49.72,85.08 arc90 49.28,85.52 31.7,85.52 v30.99,84.81
SDRAMIO_SDRAM_ADDR_O_7  (via drill 0.35)
  Top 0.254: v56.36,85.5 56.37,85.51 IC3.32 | v30.23,85.74 30.23,91.69 SOCKET_1.20
  Bottom 0.254: v30.23,85.74 30.62,86.13 31.04,86.13 arc90 31.49,86.58 31.49,86.65 arc-90 31.93,87.09 31.95,87.09 arc-90 32.39,86.65 32.39,86.58 arc90 32.84,86.13 32.85,86.13 arc90 33.3,86.58 33.3,86.65 arc-90 33.74,87.09 33.76,87.09 arc-90 34.2,86.65 34.2,86.58 arc90 34.65,86.13 34.66,86.13 arc90 35.11,86.58 35.11,86.65 arc-90 35.55,87.09 35.56,87.09 arc-90 36.01,86.65 36.01,86.58 arc90 36.45,86.13 36.47,86.13 arc90 36.91,86.58 36.91,86.65 arc-90 37.36,87.09 37.37,87.09 arc-90 37.82,86.65 37.82,86.58 arc90 38.26,86.13 38.28,86.13 arc90 38.72,86.58 38.72,86.65 arc-90 39.17,87.09 39.18,87.09 arc-90 39.63,86.65 39.63,86.58 arc90 40.07,86.13 40.09,86.13 arc90 40.53,86.58 40.53,86.65 arc-90 40.98,87.09 40.99,87.09 arc-90 41.44,86.65 41.44,86.58 arc90 41.88,86.13 41.9,86.13 arc90 42.34,86.58 42.34,86.65 arc-90 42.78,87.09 42.8,87.09 arc-90 43.24,86.65 43.24,86.58 arc90 43.69,86.13 54.2,86.13 54.84,85.5 v56.36,85.5
SDRAMIO_SDRAM_ADDR_O_8  (via drill 0.35)
  Top 0.254: SOCKET_1.23 22.73,93.85 24.6,93.85 29.46,88.99 v29.46,86.48 | v55.81,86.43 55.93,86.31 IC3.33
  Bottom 0.254: v29.46,86.48 31.7,88.72 46.48,88.72 arc-90 46.93,88.27 46.93,87.55 arc90 47.37,87.11 47.41,87.11 arc90 47.85,87.55 47.85,88.27 arc-90 48.3,88.72 48.33,88.72 arc-90 48.78,88.27 48.78,87.55 arc90 49.22,87.11 49.26,87.11 arc90 49.7,87.55 49.7,88.27 arc-90 50.15,88.72 50.19,88.72 arc-90 50.63,88.27 50.63,87.55 arc90 51.08,87.11 51.11,87.11 arc90 51.56,87.55 51.56,88.27 arc-90 52,88.72 52.39,88.72 54.67,86.43 v55.81,86.43
SDRAMIO_SDRAM_ADDR_O_9  (via drill 0.35)
  Top 0.254: v56.85,87.17 56.91,87.11 IC3.34 | SOCKET_1.24 25.02,91.82 25.9,91.82 28.75,88.97 v28.75,87.22
  Bottom 0.254: v56.85,87.17 54.95,87.17 52.79,89.33 52.2,89.33 arc-90 51.75,89.77 51.75,89.8 arc90 51.31,90.25 51.24,90.25 arc90 50.8,89.8 50.8,89.77 arc-90 50.35,89.33 50.28,89.33 arc-90 49.84,89.77 49.84,89.8 arc90 49.4,90.25 49.33,90.25 arc90 48.88,89.8 48.88,89.77 arc-90 48.44,89.33 48.37,89.33 arc-90 47.93,89.77 47.93,89.8 arc90 47.48,90.25 47.41,90.25 arc90 46.97,89.8 46.97,89.77 arc-90 46.53,89.33 46.46,89.33 arc-90 46.01,89.77 46.01,89.8 arc90 45.57,90.25 45.5,90.25 arc90 45.06,89.8 45.06,89.77 arc-90 44.61,89.33 44.55,89.33 arc-90 44.1,89.77 44.1,89.8 arc90 43.66,90.25 43.59,90.25 arc90 43.15,89.8 43.15,89.77 arc-90 42.7,89.33 42.63,89.33 arc-90 42.19,89.77 42.19,89.8 arc90 41.74,90.25 41.68,90.25 arc90 41.23,89.8 41.23,89.77 arc-90 40.79,89.33 40.72,89.33 arc-90 40.28,89.77 40.28,89.8 arc90 39.83,90.25 39.76,90.25 arc90 39.32,89.8 39.32,89.77 arc-90 38.88,89.33 38.81,89.33 arc-90 38.36,89.77 38.36,89.8 arc90 37.92,90.25 37.85,90.25 arc90 37.41,89.8 37.41,89.77 arc-90 36.96,89.33 36.9,89.33 arc-90 36.45,89.77 36.45,89.8 arc90 36.01,90.25 35.94,90.25 arc90 35.49,89.8 35.49,89.77 arc-90 35.05,89.33 34.98,89.33 arc-90 34.54,89.77 34.54,89.8 arc90 34.09,90.25 34.03,90.25 arc90 33.58,89.8 33.58,89.77 arc-90 33.14,89.33 33.07,89.33 arc-90 32.62,89.77 32.62,89.8 arc90 32.18,90.25 32.11,90.25 arc90 31.67,89.8 31.67,89.77 arc-90 31.22,89.33 30.86,89.33 v28.75,87.22
SDRAMIO_SDRAM_ADDR_O_10
  Top 0.254: SOCKET_1.25 22.73,91.31 25.69,91.31 28.07,88.94 28.07,86.4 arc-90 28.07,85.77 27.95,85.65 arc90 27.95,85.02 27.96,85.01 arc90 28.58,85.01 28.71,85.13 arc-90 29.33,85.13 29.34,85.12 arc-90 29.34,84.49 29.22,84.37 arc90 29.22,83.74 29.23,83.73 arc90 29.86,83.73 29.98,83.86 arc-90 30.61,83.86 30.62,83.85 arc-90 30.62,83.22 30.5,83.09 arc90 30.5,82.47 30.51,82.46 arc90 31.14,82.46 31.26,82.58 arc-90 31.89,82.58 31.9,82.57 arc-90 31.9,81.94 31.78,81.82 arc90 31.78,81.19 31.79,81.18 arc90 32.42,81.18 32.54,81.3 arc-90 33.17,81.3 33.17,81.29 arc-90 33.17,80.66 33.05,80.54 arc90 33.05,79.91 33.06,79.9 arc90 33.69,79.9 33.81,80.03 arc-90 34.44,80.03 34.45,80.02 arc-90 34.45,79.39 34.33,79.26 arc90 34.33,78.64 34.34,78.63 arc90 34.97,78.63 35.09,78.75 arc-90 35.72,78.75 37,77.47 45.97,77.47 49.53,81.03 49.53,85.34 48.56,86.31 IC3.22
SDRAMIO_SDRAM_ADDR_O_11  (via drill 0.35)
  Top 0.254: v56.26,87.91 IC3.35 | v27.31,88.09 27.23,88.16 27.23,89.06 26.12,90.17 SOCKET_1.26
  Bottom 0.254: v56.26,87.91 55.37,87.91 52.45,90.83 51.82,90.83 arc-90 51.37,91.27 51.37,91.32 arc90 50.93,91.76 50.92,91.76 arc90 50.48,91.32 50.48,91.27 arc-90 50.03,90.83 50.03,90.83 arc-90 49.59,91.27 49.59,91.32 arc90 49.14,91.76 49.14,91.76 arc90 48.69,91.32 48.69,91.27 arc-90 48.25,90.83 48.25,90.83 arc-90 47.8,91.27 47.8,91.32 arc90 47.36,91.76 47.35,91.76 arc90 46.91,91.32 46.91,91.27 arc-90 46.46,90.83 46.46,90.83 arc-90 46.02,91.27 46.02,91.32 arc90 45.57,91.76 45.57,91.76 arc90 45.12,91.32 45.12,91.27 arc-90 44.68,90.83 44.67,90.83 arc-90 44.23,91.27 44.23,91.32 arc90 43.79,91.76 43.78,91.76 arc90 43.34,91.32 43.34,91.27 arc-90 42.89,90.83 42.89,90.83 arc-90 42.44,91.27 42.44,91.32 arc90 42,91.76 42,91.76 arc90 41.55,91.32 41.55,91.27 arc-90 41.11,90.83 41.1,90.83 arc-90 40.66,91.27 40.66,91.32 arc90 40.21,91.76 40.21,91.76 arc90 39.77,91.32 39.77,91.27 arc-90 39.32,90.83 39.32,90.83 arc-90 38.87,91.27 38.87,91.32 arc90 38.43,91.76 38.42,91.76 arc90 37.98,91.32 37.98,91.27 arc-90 37.54,90.83 37.53,90.83 arc-90 37.09,91.27 37.09,91.32 arc90 36.64,91.76 36.64,91.76 arc90 36.2,91.32 36.2,91.27 arc-90 35.75,90.83 35.75,90.83 arc-90 35.3,91.27 35.3,91.32 arc90 34.86,91.76 34.85,91.76 arc90 34.41,91.32 34.41,91.27 arc-90 33.97,90.83 33.96,90.83 arc-90 33.52,91.27 33.52,91.32 arc90 33.07,91.76 33.07,91.76 arc90 32.62,91.32 32.62,91.27 arc-90 32.18,90.83 32.18,90.83 arc-90 31.73,91.27 31.73,91.32 arc90 31.29,91.76 31.28,91.76 arc90 30.84,91.32 30.84,91.27 arc-90 30.39,90.83 30.05,90.83 v27.31,88.09
SDRAMIO_SDRAM_ADDR_O_12  (via drill 0.35)
  Top 0.254: SOCKET_1.27 22.73,88.77 v26.54,88.77 | IC3.36 59.01,88.77 v55.63,88.77
  Bottom 0.254: v26.54,88.77 30.1,92.33 30.33,92.33 arc90 30.78,92.77 30.78,92.81 arc-90 31.22,93.26 31.38,93.26 arc-90 31.83,92.81 31.83,92.77 arc90 32.27,92.33 32.43,92.33 arc90 32.88,92.77 32.88,92.81 arc-90 33.32,93.26 33.48,93.26 arc-90 33.93,92.81 33.93,92.77 arc90 34.37,92.33 34.53,92.33 arc90 34.98,92.77 34.98,92.81 arc-90 35.42,93.26 35.59,93.26 arc-90 36.03,92.81 36.03,92.77 arc90 36.47,92.33 36.64,92.33 arc90 37.08,92.77 37.08,92.81 arc-90 37.52,93.26 37.69,93.26 arc-90 38.13,92.81 38.13,92.77 arc90 38.58,92.33 38.74,92.33 arc90 39.18,92.77 39.18,92.81 arc-90 39.62,93.26 39.79,93.26 arc-90 40.23,92.81 40.23,92.77 arc90 40.68,92.33 40.84,92.33 arc90 41.28,92.77 41.28,92.81 arc-90 41.73,93.26 41.89,93.26 arc-90 42.33,92.81 42.33,92.77 arc90 42.78,92.33 42.94,92.33 arc90 43.38,92.77 43.38,92.81 arc-90 43.83,93.26 43.99,93.26 arc-90 44.43,92.81 44.43,92.77 arc90 44.88,92.33 45.04,92.33 arc90 45.48,92.77 45.48,92.81 arc-90 45.93,93.26 46.09,93.26 arc-90 46.53,92.81 46.53,92.77 arc90 46.98,92.33 47.14,92.33 arc90 47.59,92.77 47.59,92.81 arc-90 48.03,93.26 48.19,93.26 arc-90 48.64,92.81 48.64,92.77 arc90 49.08,92.33 49.24,92.33 arc90 49.69,92.77 49.69,92.81 arc-90 50.13,93.26 50.29,93.26 arc-90 50.74,92.81 50.74,92.77 arc90 51.18,92.33 52.07,92.33 v55.63,88.77
SDRAMIO_SDRAM_BA_O_0
  Top 0.254: IC3.21 47.73,86.99 48.6,86.99 50.04,85.55 50.04,80.82 46.18,76.96 34.8,76.96 SOCKET_1.28
SDRAMIO_SDRAM_BA_O_1
  Top 0.254: IC3.20 47.73,87.79 48.52,87.79 50.55,85.77 50.55,80.61 46.4,76.45 34.59,76.45 24.68,86.36 22.86,86.36 SOCKET_1.29
SDRAMIO_SDRAM_CAS_O
  Top 0.254: SOCKET_1.7 22.86,114.3 25.53,114.3 38.39,101.44 38.39,91.28 39.36,90.31 IC3.17
SDRAMIO_SDRAM_CKE_O  (via drill 0.35)
  Top 0.254: SOCKET_1.4 30.33,111.92 31.25,111.92 39.91,103.25 39.91,95.01 v40.26,94.67 | IC3.37 55.86,89.51 v55.29,90.08
  Bottom 0.254: v40.26,94.67 50.7,94.67 v55.29,90.08
SDRAMIO_SDRAM_CLK_O  (via drill 0.35)
  Top 0.406: IC3.38 59.05,90.3 v56.26,90.3
  Top 0.508: v27.81,117.09 25.53,119.38 22.86,119.38 SOCKET_1.3
  Bottom 0.508: v56.26,90.3 29.46,117.09 v27.81,117.09
SDRAMIO_SDRAM_CS_O
  Top 0.254: IC3.19 47.73,88.59 48.44,88.59 51.05,85.98 51.05,80.4 46.61,75.95 34.38,75.95 26.5,83.82 21.24,83.82 20.19,84.87 20.19,114.17 SOCKET_1.5
SDRAMIO_SDRAM_DQM_O_0  (via drill 0.35)
  Top 0.254: SOCKET_1.9 22.51,110.49 23.66,111.63 26.15,111.63 v26.47,111.31 | IC3.15 47.49,91.79 45.9,91.79 45.44,91.33 39.99,91.33 39.41,91.91 39.41,102.79 v30.97,111.23
  Bottom 0.254: v30.97,111.23 26.55,111.23 v26.47,111.31
SDRAMIO_SDRAM_DQM_O_1  (via drill 0.35)
  Top 0.254: SOCKET_1.10 27.56,107.06 29.88,107.06 36.51,100.44 36.51,94.16 v36.69,93.98 | IC3.39 59.02,91.06 54.86,91.06 51.94,93.98 v50.16,93.98
  Bottom 0.254: v36.69,93.98 v50.16,93.98
SDRAMIO_SDRAM_RAS_O
  Top 0.254: IC3.18 47.73,89.39 48.42,89.39 51.56,86.25 51.56,80.18 46.82,75.44 34.17,75.44 28.2,81.41 21.12,81.41 19.69,82.84 19.69,115.57 20.95,116.84 22.86,116.84 SOCKET_1.6
SDRAMIO_SDRAM_WE_O  (via drill 0.35)
  Top 0.254: v28.19,113.03 38.9,102.33 38.9,91.7 39.78,90.82 46.24,90.82 46.53,91.11 IC3.16 | SOCKET_1.8 25.83,113.03 v26.47,112.39
  Bottom 0.254: v26.47,112.39 27.11,113.03 v28.19,113.03
SDRAMIO_SYSTEM_SDRAM_0_SDRAM_DATA_I_SDRAM_DATA_0
  Top 0.254: IC3.2 48.46,102.31 48.77,102.62 48.77,113.9 49.17,114.3 arc90 49.17,114.93 48.16,115.94 arc-90 48.16,116.57 48.34,116.75 arc-90 48.96,116.75 49.98,115.74 arc90 50.6,115.74 50.78,115.92 arc90 50.78,116.54 49.77,117.56 arc-90 49.77,118.19 49.95,118.36 arc-90 50.58,118.36 51.59,117.35 arc90 52.22,117.35 52.4,117.53 arc90 52.4,118.16 51.38,119.17 arc-90 51.38,119.8 51.56,119.98 arc-90 52.19,119.98 53.2,118.96 arc90 53.83,118.96 54.01,119.14 arc90 54.01,119.77 53,120.78 arc-90 53,121.41 53.18,121.59 arc-90 53.8,121.59 54.82,120.58 arc90 55.45,120.58 56.66,121.79 65.91,121.79 SOCKET_4.20
SDRAMIO_SYSTEM_SDRAM_0_SDRAM_DATA_I_SDRAM_DATA_1
  Top 0.254: SOCKET_4.19 68.58,124.46 68.58,122.72 67.15,121.28 58.78,121.28 57.9,120.41 arc-90 57.27,120.41 56.99,120.69 arc90 56.36,120.69 56.31,120.63 arc90 56.31,120.01 56.59,119.73 arc-90 56.59,119.1 56.54,119.05 arc-90 55.91,119.05 55.63,119.33 arc90 55,119.33 54.95,119.27 arc90 54.95,118.65 55.23,118.37 arc-90 55.23,117.74 55.18,117.69 arc-90 54.55,117.69 54.27,117.96 arc90 53.64,117.96 53.59,117.91 arc90 53.59,117.28 53.87,117.01 arc-90 53.87,116.38 53.82,116.33 arc-90 53.19,116.33 52.91,116.6 arc90 52.28,116.6 52.23,116.55 arc90 52.23,115.92 52.51,115.65 arc-90 52.51,115.02 52.45,114.96 arc-90 51.83,114.96 51.55,115.24 arc90 50.92,115.24 50.87,115.19 arc90 50.87,114.56 51.15,114.28 arc-90 51.15,113.66 51.09,113.6 arc-90 50.47,113.6 50.19,113.88 arc90 49.56,113.88 49.51,113.83 arc90 49.51,113.2 49.79,112.92 arc-90 49.79,112.29 49.28,111.79 49.28,101.47 48.51,100.71 IC3.4
SDRAMIO_SYSTEM_SDRAM_0_SDRAM_DATA_I_SDRAM_DATA_2
  Top 0.254: IC3.5 48.48,99.91 49.78,101.22 49.78,109.54 50.51,110.27 arc90 50.51,110.9 50.18,111.23 arc-90 50.18,111.86 50.21,111.9 arc-90 50.84,111.9 51.18,111.56 arc90 51.8,111.56 51.84,111.6 arc90 51.84,112.23 51.51,112.56 arc-90 51.51,113.19 51.54,113.23 arc-90 52.17,113.23 52.51,112.89 arc90 53.13,112.89 53.17,112.93 arc90 53.17,113.56 52.84,113.89 arc-90 52.84,114.52 52.87,114.56 arc-90 53.5,114.56 53.84,114.22 arc90 54.46,114.22 54.5,114.26 arc90 54.5,114.89 54.17,115.22 arc-90 54.17,115.85 54.2,115.89 arc-90 54.83,115.89 55.16,115.55 arc90 55.79,115.55 55.83,115.59 arc90 55.83,116.22 55.5,116.55 arc-90 55.5,117.18 55.53,117.22 arc-90 56.16,117.22 56.49,116.88 arc90 57.12,116.88 57.16,116.92 arc90 57.16,117.55 56.83,117.88 arc-90 56.83,118.51 56.86,118.55 arc-90 57.49,118.55 57.82,118.21 arc90 58.45,118.21 58.49,118.25 arc90 58.49,118.88 58.16,119.21 arc-90 58.16,119.84 58.19,119.88 arc-90 58.82,119.88 59.15,119.54 arc90 59.78,119.54 61.02,120.78 67.44,120.78 SOCKET_4.18
SDRAMIO_SYSTEM_SDRAM_0_SDRAM_DATA_I_SDRAM_DATA_3